# EAGLE board BeagleBone_Black_egl (EAGLE 6.2), part 1 of 4
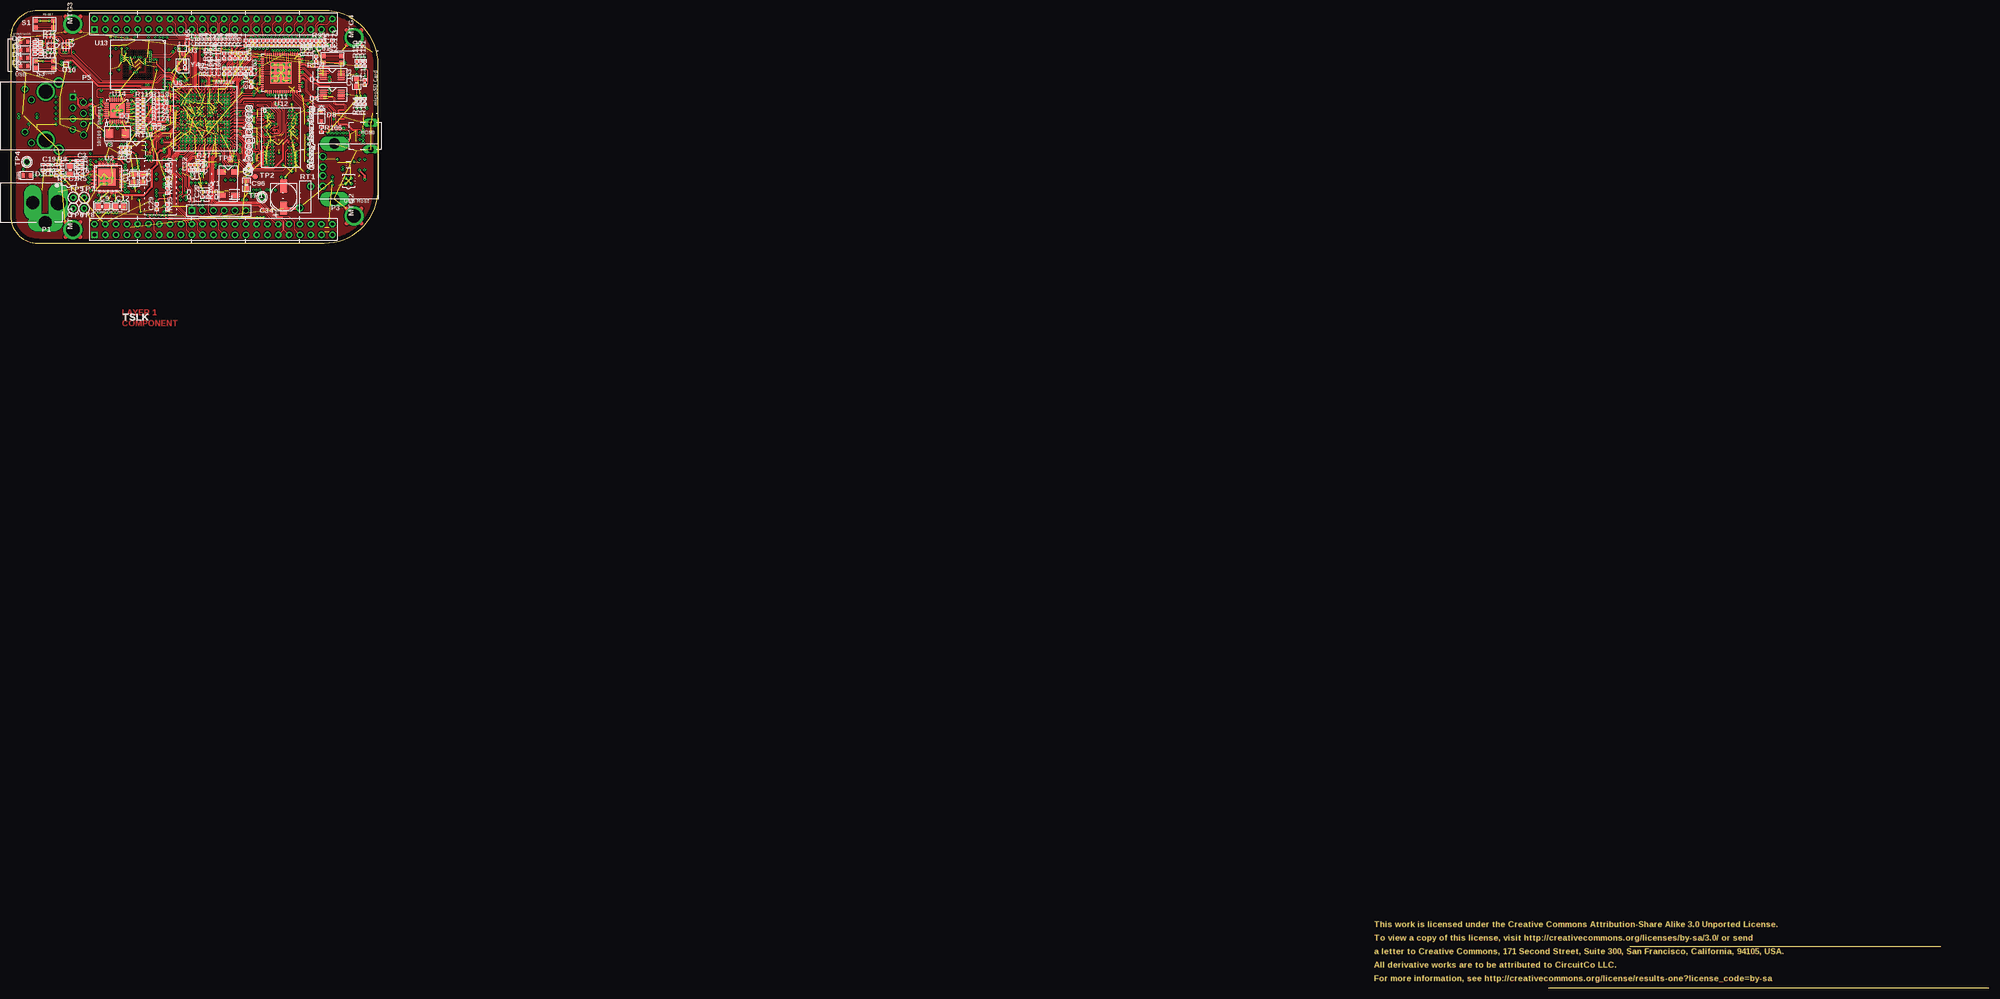
[diagram p14: board, top side]
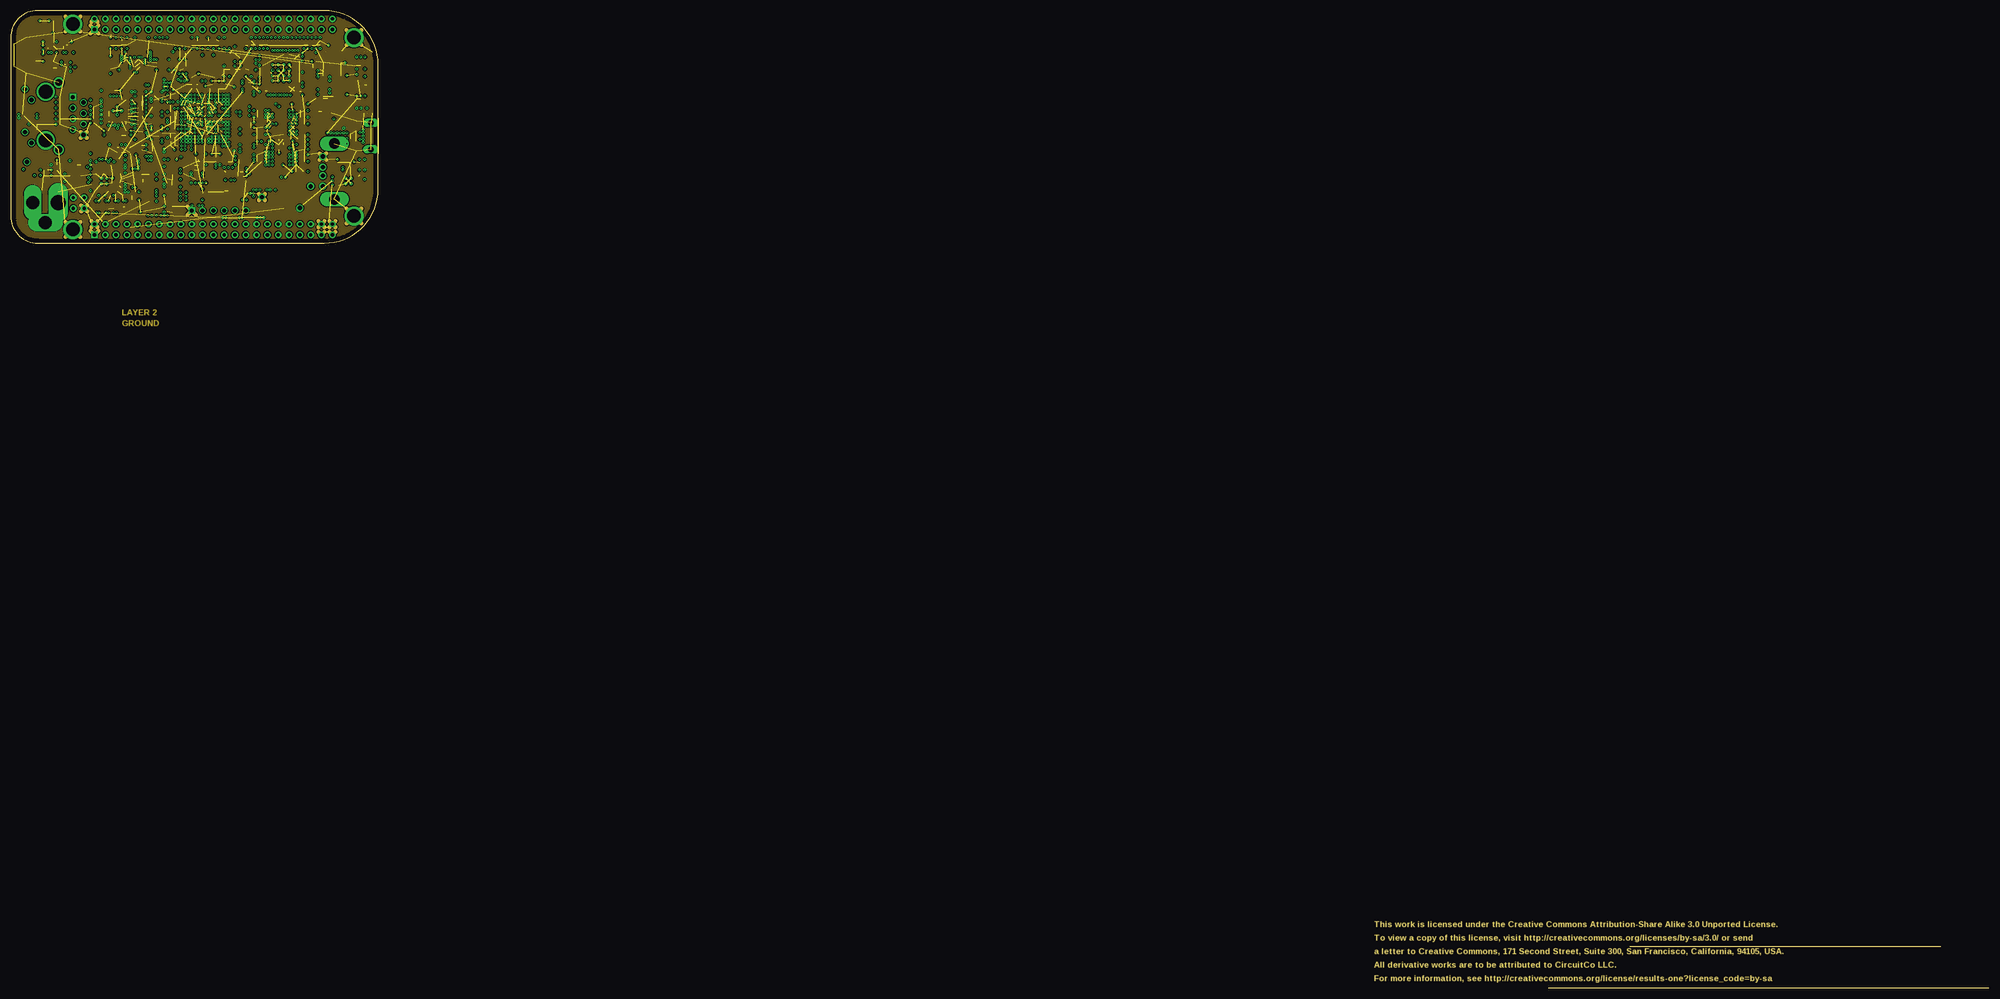
[diagram p15: board, inner layer Route2]
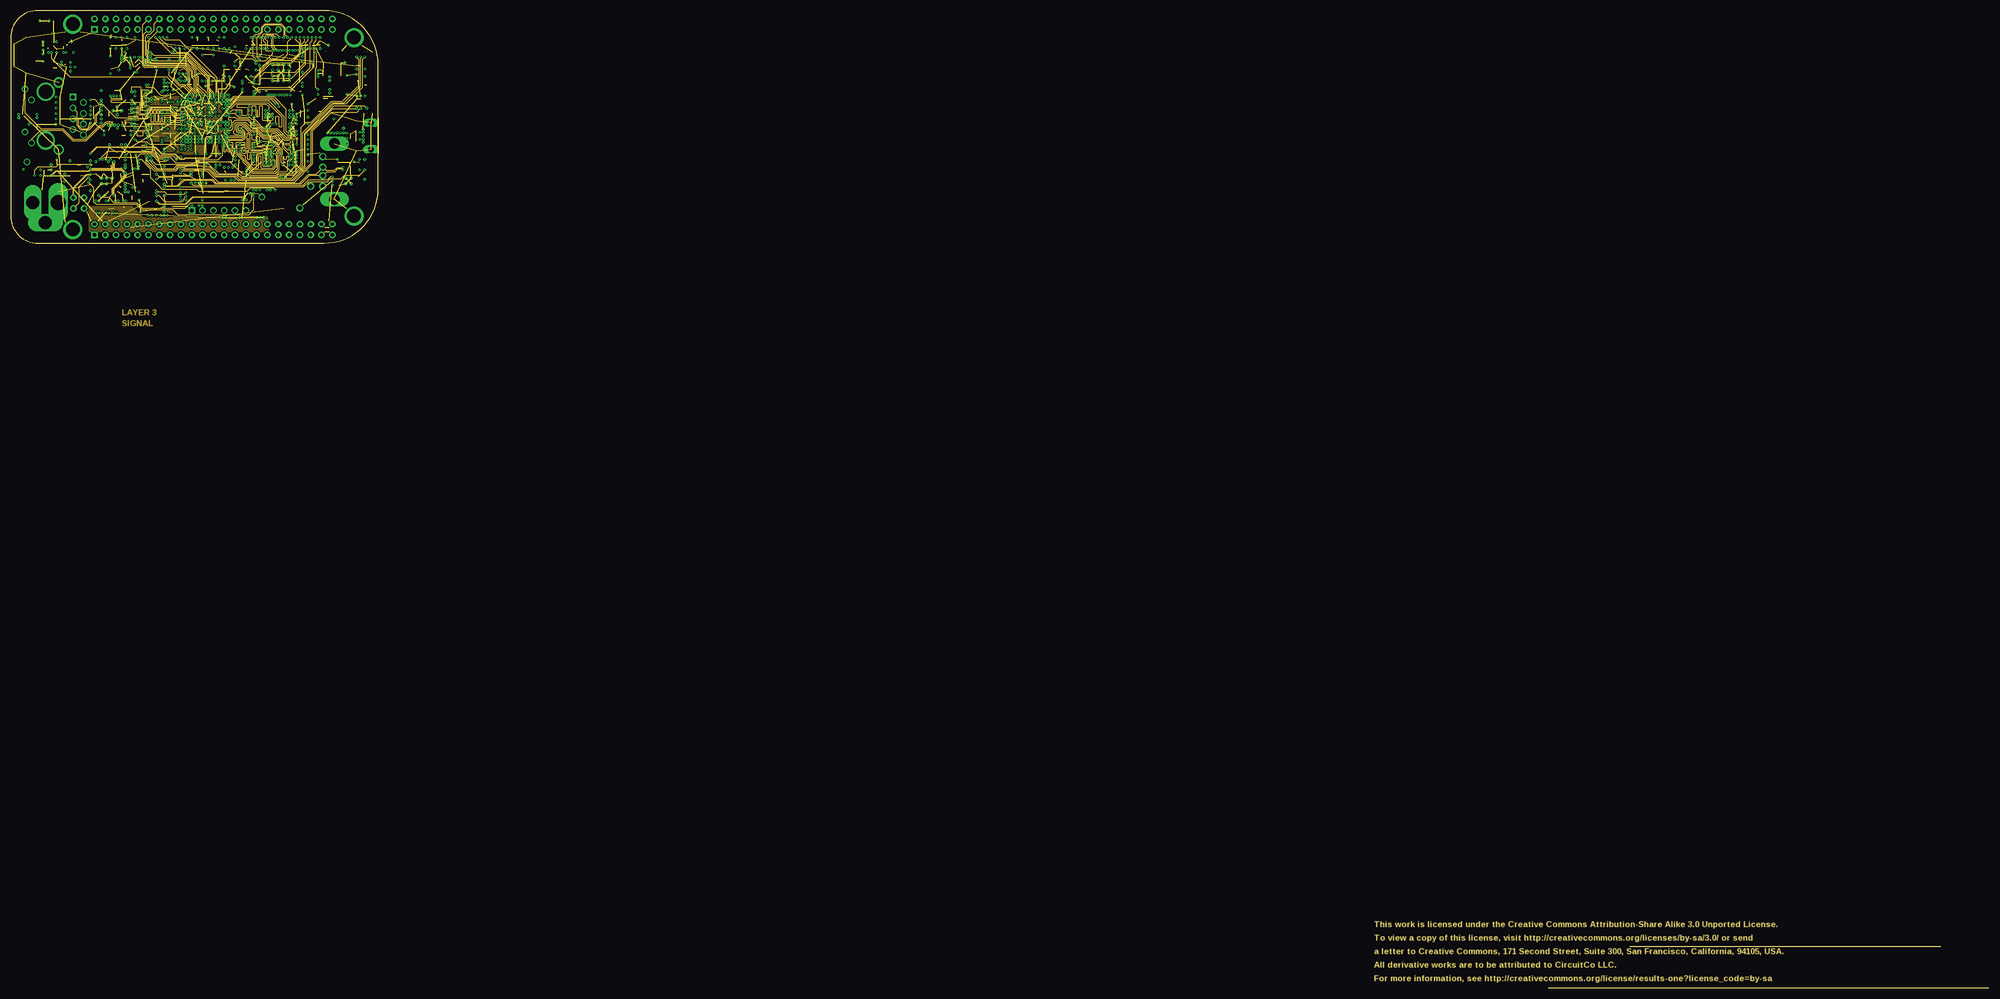
[diagram p16: board, inner layer Route3]
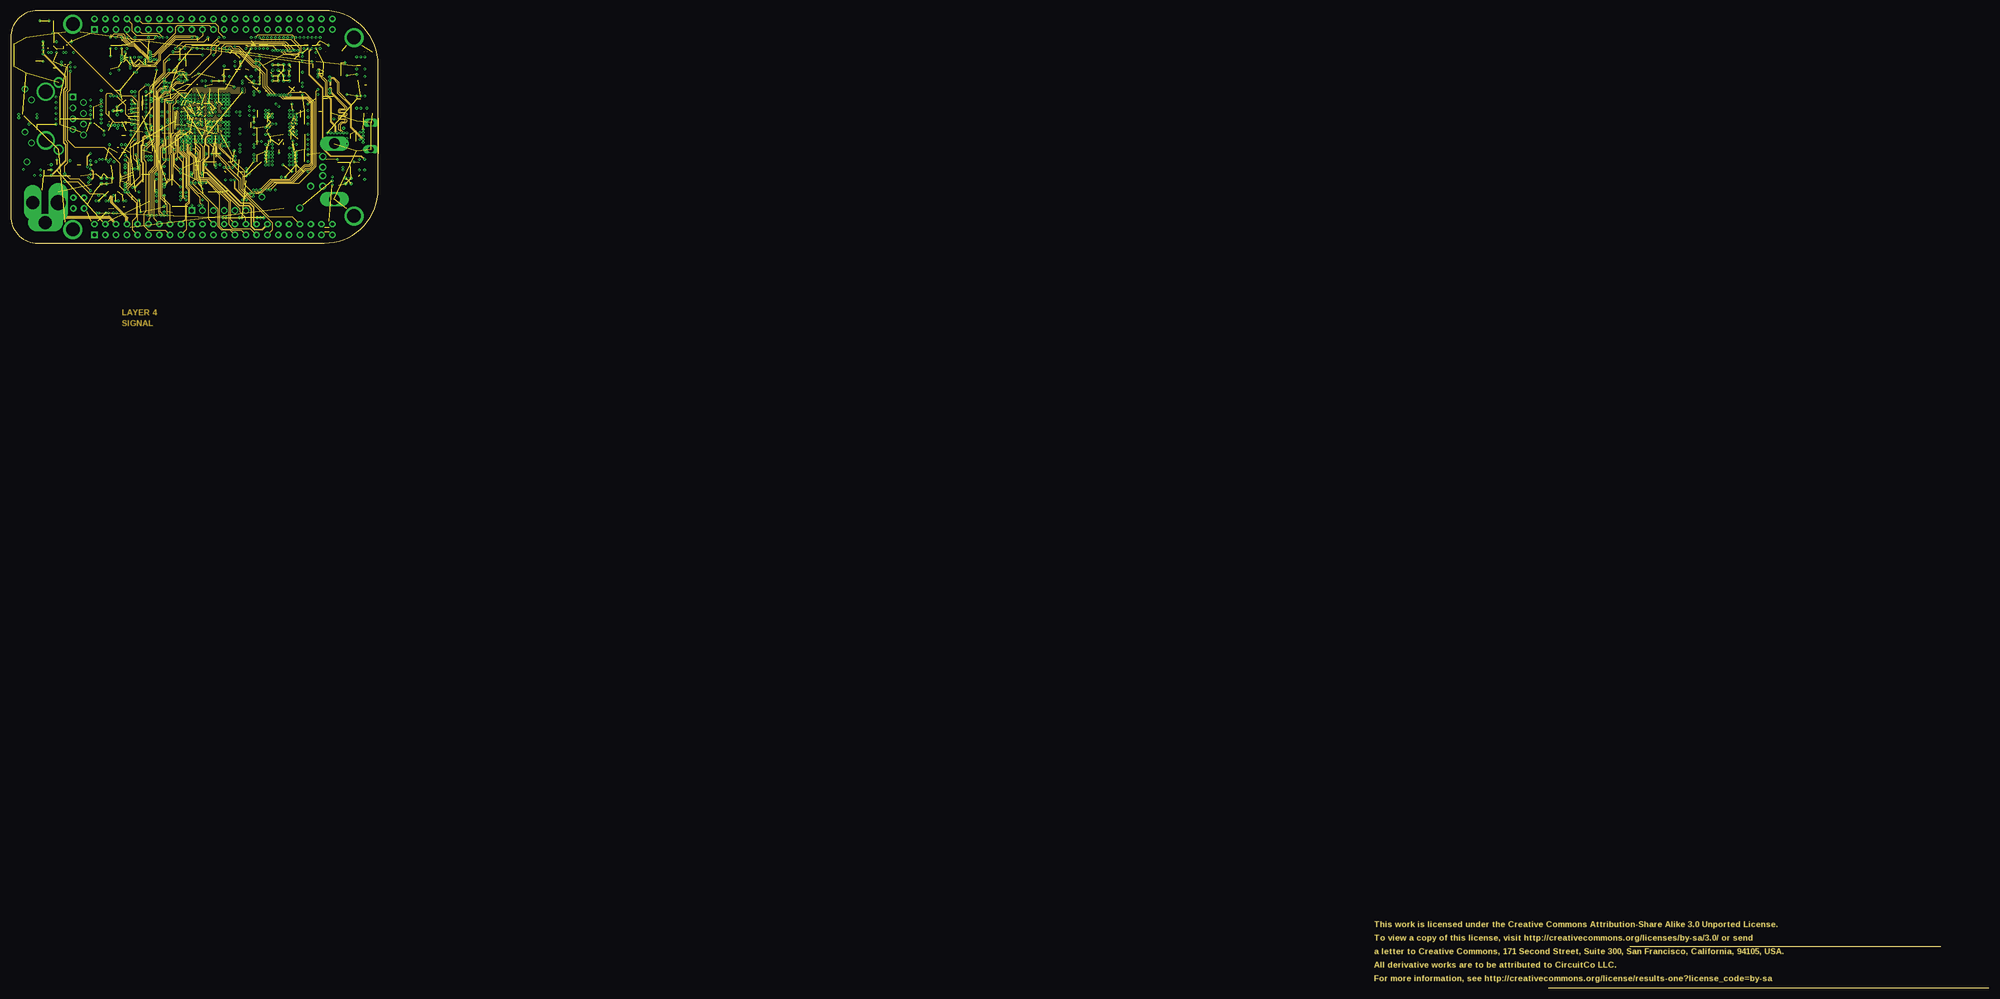
[diagram p17: board, inner layer Route14]
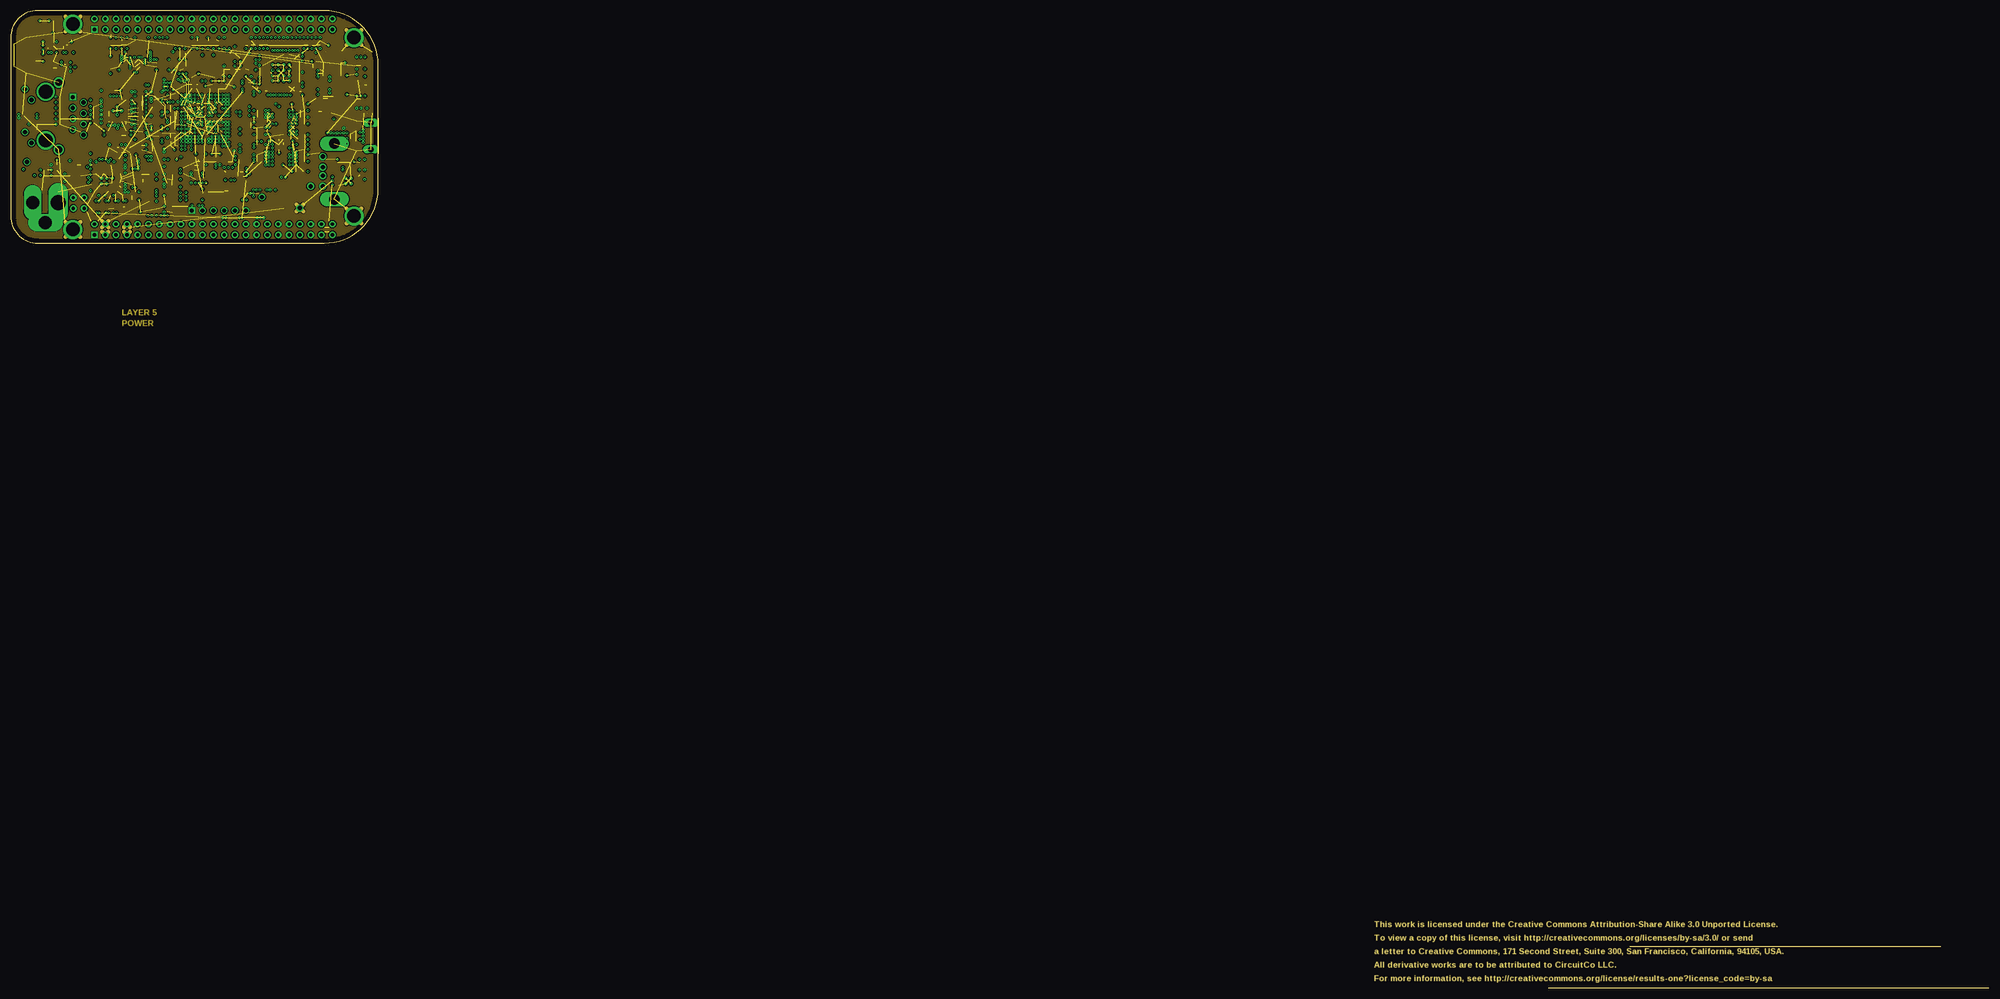
[diagram p18: board, inner layer Route15]
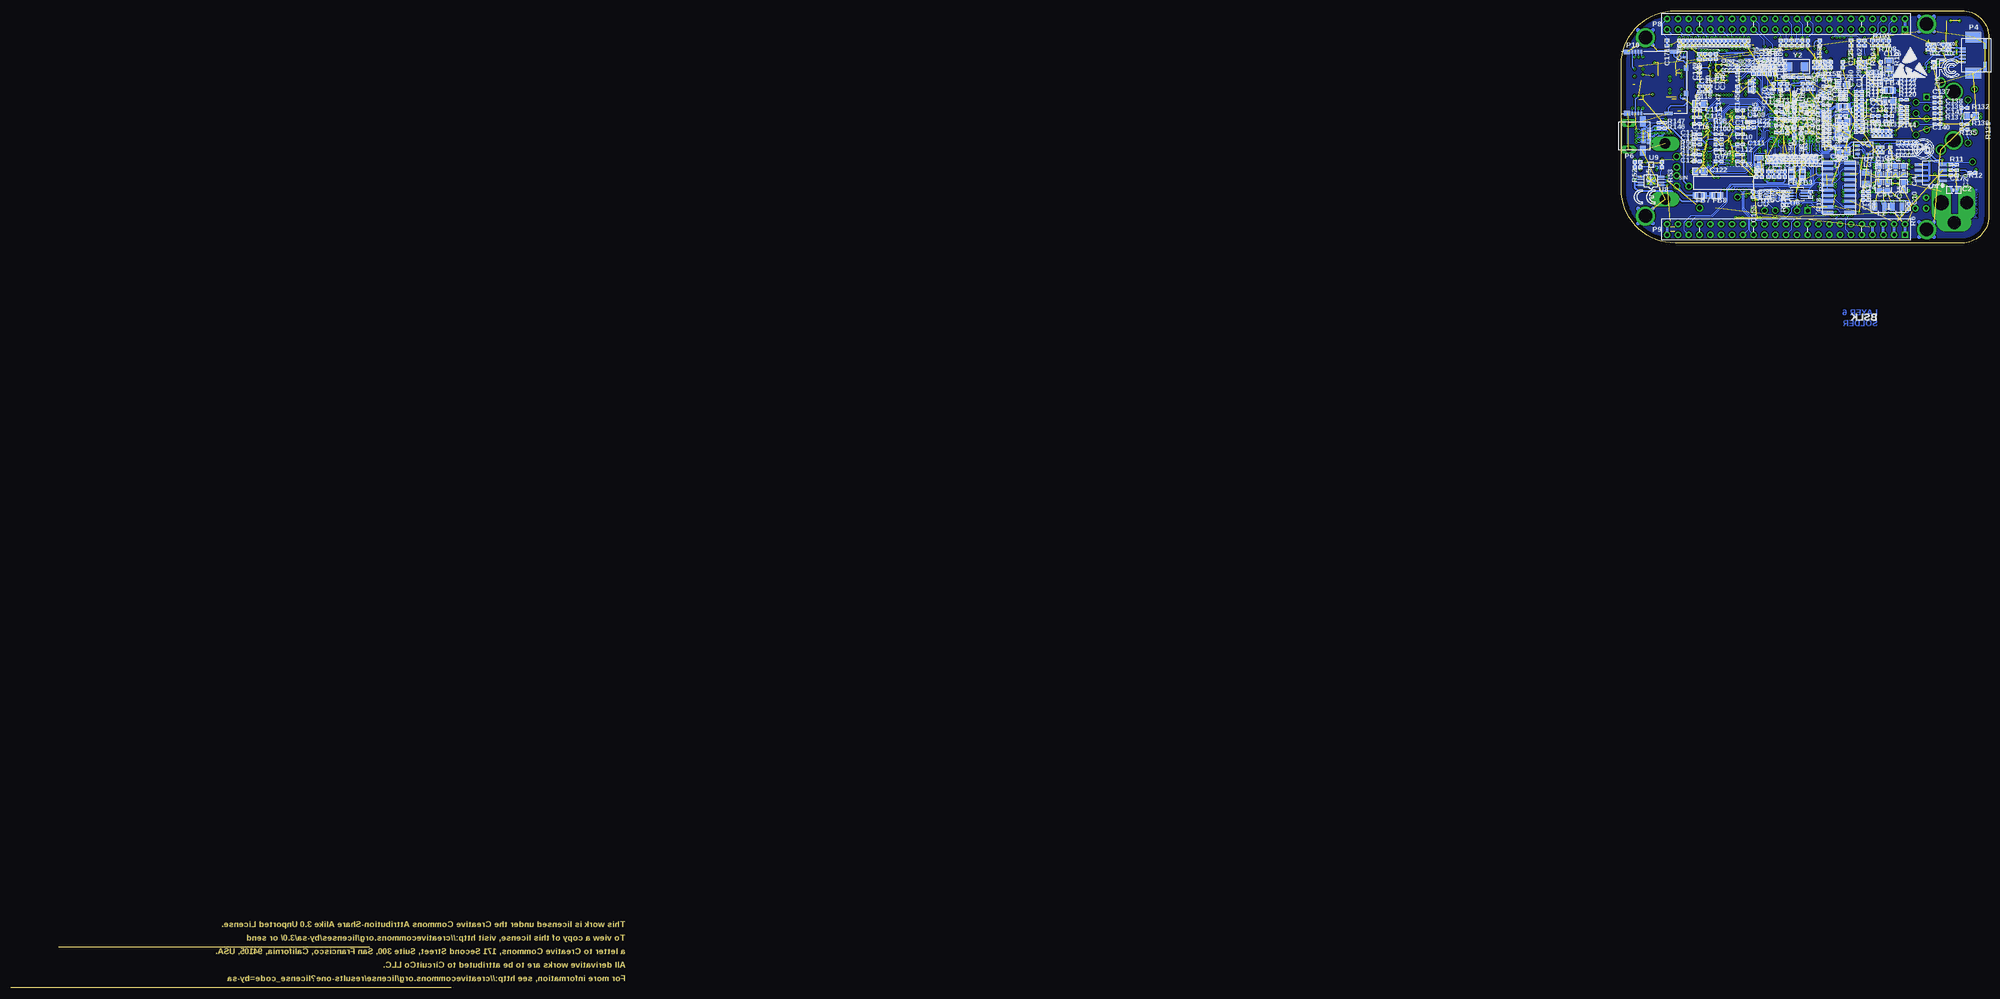
[diagram p19: board, bottom side, seen from below]

Size 464.69 x 229.62 mm. Coordinates in mm from the lower left corner, seen from the top.
Outline: 73.66,175.01 arc90 86.36,187.71
Outline: 86.36,216.92 arc90 73.66,229.62
Outline: 6.35,229.62 arc90 0,223.27
Outline: 0,181.36 arc90 6.35,175.01
Outline: 453.39,9.65 380.37,9.65
Outline: 361.19,0 464.69,0
Outline: 6.35,175.01 73.66,175.01
Outline: 73.66,175.01 arc90 86.36,187.71
Outline: 86.36,187.71 86.36,216.92
Outline: 86.36,216.92 arc90 73.66,229.62
Outline: 73.66,229.62 6.35,229.62
Outline: 6.35,229.62 arc90 0,223.27
Outline: 0,223.27 0,181.36
Outline: 0,181.36 arc90 6.35,175.01
Copper layers (1*2*3*14*15*16): Top 0.035mm / dielectric 1.5mm / Route2 0.035mm / dielectric 0.15mm / Route3 0.035mm / dielectric 0.2mm / Route14 0.035mm / dielectric 0.15mm / Route15 0.035mm / dielectric 0.2mm / Bottom 0.035mm
Design rules: minimum track width 10mil, minimum drill 24mil, track to track 8mil, track to pad 8mil, pad to pad 8mil, via to via 8mil, smd to smd 8mil, copper to edge 40mil, drill to drill 8mil, minimum pad ring 10mil, minimum via ring 8mil, stop-mask expansion 4mil, vias tented up to drill 0mil, thermal gap 10mil

## Footprints (pad centres in the part's own frame; a part is rotated, then mirrored left to right if it is on the bottom)
805 = smd 1.143 x 1.27: 1 -0.889,0; 2 0.889,0
402 = smd 0.635 x 0.508: 1 -0.508,0; 2 0.508,0
RD205SMD_250D = smd 3.048 x 1.651: 1 -2.603,0; 2 2.603,0
0402 = smd 0.635 x 0.508: 1 -0.508,0; 2 0.508,0
LED_0603 = smd 0.762 x 1.016: 1 -0.826,0; 2 0.826,0
TSSOP10 = smd 0.305 x 1.905: 1 -1,-1.981 | smd 0.305 x 1.651: 2 -0.5,-2.108; 3 0,-2.108; 4 0.5,-2.108; 5 1,-2.108; 6 1,2.108; 7 0.5,2.108; 8 0,2.108; 9 -0.5,2.108; 10 -1,2.108
SOD323 = smd 0.8 x 0.8: 1 1.125,0; 2 -1.125,0
SM-7351-IND-0805 = smd 1.397 x 1.549: 1 -0.95,0; 2 0.95,0
SIP6 = drill 1.016 pad 1.524 square: 1 0,0 | drill 1.016 pad 1.524: 2 0,-2.54; 3 0,-5.08; 4 0,-7.62; 5 0,-10.16; 6 0,-12.7
2520 = smd 1.143 x 1.905: 1 -1.143,0; 2 1.143,0
MTGH200C125D_PL = drill 3.175 pad 4.445: 1 0,0
CONN3-PWR-PJ102A = drill 3.556 pad 1.778 long: 1 0,0 | drill 3.048 pad 1.778 long: 2 5.994,0; 3 2.997,4.699
HEADER10X2_SMD = smd 0.711 x 2.794: 1 -5.715,-2.705; 2 -5.715,2.705; 3 -4.445,-2.705; 4 -4.445,2.705; 5 -3.175,-2.705; 6 -3.175,2.705; 7 -1.905,-2.705; 8 -1.905,2.705; 9 -0.635,-2.705; 10 -0.635,2.705; 11 0.635,-2.705; 12 0.635,2.705; 13 1.905,-2.705; 14 1.905,2.705; 15 3.175,-2.705; 16 3.175,2.705; 17 4.445,-2.705; 18 4.445,2.705; 19 5.715,-2.705; 20 5.715,2.705
USB_A_SH = drill 1.016 pad 1.651: 1 0,0; 2 2.499,0; 3 4.501,0; 4 7,0 | drill 2.413 pad 2.032 long: 5 -3.071,-2.71; 6 10.071,-2.71
USB5MINI_4SHIELDED_SMD-5 = smd 1.4 x 0.5: 1 0,1.6; 2 0,0.8; 3 0,0; 4 0,-0.8; 5 0,-1.6 | smd 3.81 x 2.54: 6 -2.4,4.2; 7 -2.4,-4.2 | smd 0.8 x 2.35: 8 -5.2,2.675; 9 -5.2,-2.675
RJ45-7499010211A = drill 1.016 pad 1.524 square: 1 0,0 | drill 1.016 pad 1.524: 2 1.27,2.54; 3 2.54,0; 4 3.81,2.54; 5 5.08,0; 6 6.35,2.54; 7 7.62,0; 8 8.89,2.54; 9 -1.88,-11.252; 10 0.66,-9.728; 11 8.23,-11.252; 12 10.77,-9.728 | drill 1.6 pad 2.286: 13 -3.429,-3.302; 14 12.319,-3.302 | drill 3.251 pad 1.016: MECH_15 -1.27,-6.35; MECH_16 10.16,-6.35
CONN19_HDMI = smd 0.23 x 0.85: 1 1.8,4.765; 3 1.4,4.765; 5 1,4.765; 7 0.6,4.765; 9 0.2,4.765; 11 -0.2,4.765; 13 -0.6,4.765; 15 -1,4.765; 17 -1.4,4.765; 19 -1.8,4.765 | smd 0.23 x 1: 2 1.6,3.54; 4 1.2,3.54; 6 0.8,3.54; 8 0.4,3.54; 10 0,3.54; 12 -0.4,3.54; 14 -0.8,3.54; 16 -1.2,3.54; 18 -1.6,3.54 | drill 1.27 pad 1.651 long: 20 3.1,0; 21 -3.1,0 | smd 2.4 x 1.38: 22 3.45,3.36; 23 -3.45,3.36
HEADER23X2 = drill 0.762 pad 1.524 square: 1 0,0 | drill 0.762 pad 1.524: 2 0,2.54; 3 2.54,0; 4 2.54,2.54; 5 5.08,0; 6 5.08,2.54; 7 7.62,0; 8 7.62,2.54; 9 10.16,0; 10 10.16,2.54; 11 12.7,0; 12 12.7,2.54; 13 15.24,0; 14 15.24,2.54; 15 17.78,0; 16 17.78,2.54; 17 20.32,0; 18 20.32,2.54; 19 22.86,0; 20 22.86,2.54; 21 25.4,0; 22 25.4,2.54; 23 27.94,0; 24 27.94,2.54; 25 30.48,0; 26 30.48,2.54; 27 33.02,0; 28 33.02,2.54; 29 35.56,0; 30 35.56,2.54; 31 38.1,0; 32 38.1,2.54; 33 40.64,0; 34 40.64,2.54; 35 43.18,0; 36 43.18,2.54; 37 45.72,0; 38 45.72,2.54; 39 48.26,0; 40 48.26,2.54; 41 50.8,0; 42 50.8,2.54; 43 53.34,0; 44 53.34,2.54; 45 55.88,0; 46 55.88,2.54
SD-MICRO-SCHA5B0300 = smd 0.914 x 0.457: 1 -7.257,0; 2 -7.257,-0.7; 3 -7.257,-1.4; 4 -7.257,-2.1; 5 7.257,-2.1; 6 7.257,-1.4; 7 7.257,-0.7; 8 7.257,0 | smd 0.508 x 0.889: 9 3.775,9.989; 10 -5.975,9.989 | smd 0.889 x 2.007: 11 -7.25,7.635; 12 7.25,6.335 | smd 1.118 x 1.524: 13 -7.196,-3.365; 14 7.196,-3.365 | smd 1.194 x 1.092: 15 -3.425,10.488; 16 2.575,10.488
SMINI6-F3-B = smd 0.305 x 0.95: 1 0.65,0.75; 2 0,0.75; 3 -0.65,0.75; 4 -0.65,-0.75; 5 0,-0.75; 6 0.65,-0.75
SM-7351-RES-0402 = smd 0.635 x 0.635: 1 -0.508,0; 2 0.508,0
POLYSW200-5638-310 = drill 1.016 pad 1.651: 1 -5.08,2.54; 2 0,0
SW4SMD_63X161LS = smd 0.889 x 1.016: 1 -2.05,-0.8; 2 -2.05,0.8; 3 2.05,-0.8; 4 2.05,0.8
TP1-8040 = drill 1.016 pad 1.524: 1 0,0
TP60C_SMD = smd 1.27 x 1.27: 1 0,0
TP60C33D = drill 0.762 pad 1.524: 1 0,0
U_48_RSL = smd 0.8 x 0.2: 1 -3.075,2.2; 2 -3.075,1.8; 3 -3.075,1.4; 4 -3.075,1; 5 -3.075,0.6; 6 -3.075,0.2; 7 -3.075,-0.2; 8 -3.075,-0.6; 9 -3.075,-1; 10 -3.075,-1.4; 11 -3.075,-1.8; 12 -3.075,-2.2; 25 3.075,-2.2; 26 3.075,-1.8; 27 3.075,-1.4; 28 3.075,-1; 29 3.075,-0.6; 30 3.075,-0.2; 31 3.075,0.2; 32 3.075,0.6; 33 3.075,1; 34 3.075,1.4; 35 3.075,1.8; 36 3.075,2.2 | smd 0.2 x 0.8: 13 -2.2,-3.075; 14 -1.8,-3.075; 15 -1.4,-3.075; 16 -1,-3.075; 17 -0.6,-3.075; 18 -0.2,-3.075; 19 0.2,-3.075; 20 0.6,-3.075; 21 1,-3.075; 22 1.4,-3.075; 23 1.8,-3.075; 24 2.2,-3.075; 37 2.2,3.075; 38 1.8,3.075; 39 1.4,3.075; 40 1,3.075; 41 0.6,3.075; 42 0.2,3.075; 43 -0.2,3.075; 44 -0.6,3.075; 45 -1,3.075; 46 -1.4,3.075; 47 -1.8,3.075; 48 -2.2,3.075 | smd 4.05 x 4.05: 49 -0.225,0.225
DCK5_2P15X1P4 = smd 0.4 x 0.9: 1 -0.65,-1.1; 2 0,-1.1; 3 0.65,-1.1; 4 0.65,1.1; 5 -0.65,1.1
SO8-25X75 = smd 0.635 x 1.905: 1 -1.905,-2.794; 2 -0.635,-2.794; 3 0.635,-2.794; 4 1.905,-2.794; 5 1.905,2.794; 6 0.635,2.794; 7 -0.635,2.794; 8 -1.905,2.794
AM33XX_15X15 = smd 0.356 x 0.356: A1 -6.8,6.8; A2 -6,6.8; A3 -5.2,6.8; A4 -4.4,6.8; A5 -3.6,6.8; A6 -2.8,6.8; A7 -2,6.8; A8 -1.2,6.8; A9 -0.4,6.8; A10 0.4,6.8; A11 1.2,6.8; A12 2,6.8; A13 2.8,6.8; A14 3.6,6.8; A15 4.4,6.8; A16 5.2,6.8; A17 6,6.8; A18 6.8,6.8; B1 -6.8,6; B2 -6,6; B3 -5.2,6; B4 -4.4,6; B5 -3.6,6; B6 -2.8,6; B7 -2,6; B8 -1.2,6; B9 -0.4,6; B10 0.4,6; B11 1.2,6; B12 2,6; B13 2.8,6; B14 3.6,6; B15 4.4,6; B16 5.2,6; B17 6,6; B18 6.8,6; C1 -6.8,5.2; C2 -6,5.2; C3 -5.2,5.2; C4 -4.4,5.2; C5 -3.6,5.2; C6 -2.8,5.2; C7 -2,5.2; C8 -1.2,5.2; C9 -0.4,5.2; C10 0.4,5.2; C11 1.2,5.2; C12 2,5.2; C13 2.8,5.2; C14 3.6,5.2; C15 4.4,5.2; C16 5.2,5.2; C17 6,5.2; C18 6.8,5.2; D1 -6.8,4.4; D2 -6,4.4; D3 -5.2,4.4; D4 -4.4,4.4; D5 -3.6,4.4; D6 -2.8,4.4; D7 -2,4.4; D8 -1.2,4.4; D9 -0.4,4.4; D10 0.4,4.4; D11 1.2,4.4; D12 2,4.4; D13 2.8,4.4; D14 3.6,4.4; D15 4.4,4.4; D16 5.2,4.4; D17 6,4.4; D18 6.8,4.4; E1 -6.8,3.6; E2 -6,3.6; E3 -5.2,3.6; E4 -4.4,3.6; E5 -3.6,3.6; E6 -2.8,3.6; E7 -2,3.6; E8 -1.2,3.6; E9 -0.4,3.6; E10 0.4,3.6; E11 1.2,3.6; E12 2,3.6; E13 2.8,3.6; E14 3.6,3.6; E15 4.4,3.6; E16 5.2,3.6; E17 6,3.6; E18 6.8,3.6; F1 -6.8,2.8; F2 -6,2.8; F3 -5.2,2.8; F4 -4.4,2.8; F5 -3.6,2.8; F6 -2.8,2.8; F7 -2,2.8; F8 -1.2,2.8; F9 -0.4,2.8; F10 0.4,2.8; F11 1.2,2.8; F12 2,2.8; F13 2.8,2.8; F14 3.6,2.8; F15 4.4,2.8; F16 5.2,2.8; F17 6,2.8; F18 6.8,2.8; G1 -6.8,2; G2 -6,2; G3 -5.2,2; G4 -4.4,2; G5 -3.6,2; G6 -2.8,2; G7 -2,2; G8 -1.2,2; G9 -0.4,2; G10 0.4,2; G11 1.2,2; G12 2,2; G13 2.8,2; G14 3.6,2; G15 4.4,2; G16 5.2,2; G17 6,2; G18 6.8,2; H1 -6.8,1.2; H2 -6,1.2; H3 -5.2,1.2; H4 -4.4,1.2; H5 -3.6,1.2; H6 -2.8,1.2; H7 -2,1.2; H8 -1.2,1.2; H9 -0.4,1.2; H10 0.4,1.2; H11 1.2,1.2; H12 2,1.2; H13 2.8,1.2; H14 3.6,1.2; H15 4.4,1.2; H16 5.2,1.2; H17 6,1.2; H18 6.8,1.2; J1 -6.8,0.4; J2 -6,0.4; J3 -5.2,0.4; J4 -4.4,0.4; J5 -3.6,0.4; J6 -2.8,0.4; J7 -2,0.4; J8 -1.2,0.4; J9 -0.4,0.4; J10 0.4,0.4; J11 1.2,0.4; J12 2,0.4; J13 2.8,0.4; J14 3.6,0.4; J15 4.4,0.4; J16 5.2,0.4; J17 6,0.4; J18 6.8,0.4; K1 -6.8,-0.4; K2 -6,-0.4; K3 -5.2,-0.4; K4 -4.4,-0.4; K5 -3.6,-0.4; K6 -2.8,-0.4; K7 -2,-0.4; K8 -1.2,-0.4; K9 -0.4,-0.4; K10 0.4,-0.4; K11 1.2,-0.4; K12 2,-0.4; K13 2.8,-0.4; K14 3.6,-0.4; K15 4.4,-0.4; K16 5.2,-0.4; K17 6,-0.4; K18 6.8,-0.4; L1 -6.8,-1.2; L2 -6,-1.2; L3 -5.2,-1.2; L4 -4.4,-1.2; L5 -3.6,-1.2; L6 -2.8,-1.2; L7 -2,-1.2; L8 -1.2,-1.2; L9 -0.4,-1.2; L10 0.4,-1.2; L11 1.2,-1.2; L12 2,-1.2; L13 2.8,-1.2; L14 3.6,-1.2; L15 4.4,-1.2; L16 5.2,-1.2; L17 6,-1.2; L18 6.8,-1.2; M1 -6.8,-2; M2 -6,-2; M3 -5.2,-2; M4 -4.4,-2; M5 -3.6,-2; M6 -2.8,-2; M7 -2,-2; M8 -1.2,-2; M9 -0.4,-2; M10 0.4,-2; M11 1.2,-2; M12 2,-2; M13 2.8,-2; M14 3.6,-2; M15 4.4,-2; M16 5.2,-2; M17 6,-2; M18 6.8,-2; N1 -6.8,-2.8; N2 -6,-2.8; N3 -5.2,-2.8; N4 -4.4,-2.8; N5 -3.6,-2.8; N6 -2.8,-2.8; N7 -2,-2.8; N8 -1.2,-2.8; N9 -0.4,-2.8; N10 0.4,-2.8; N11 1.2,-2.8; N12 2,-2.8; N13 2.8,-2.8; N14 3.6,-2.8; N15 4.4,-2.8; N16 5.2,-2.8; N17 6,-2.8; N18 6.8,-2.8; P1 -6.8,-3.6; P2 -6,-3.6; P3 -5.2,-3.6; P4 -4.4,-3.6; P5 -3.6,-3.6; P6 -2.8,-3.6; P7 -2,-3.6; P8 -1.2,-3.6; P9 -0.4,-3.6; P10 0.4,-3.6; P11 1.2,-3.6; P12 2,-3.6; P13 2.8,-3.6; P14 3.6,-3.6; P15 4.4,-3.6; P16 5.2,-3.6; P17 6,-3.6; P18 6.8,-3.6; R1 -6.8,-4.4; R2 -6,-4.4; R3 -5.2,-4.4; R4 -4.4,-4.4; R5 -3.6,-4.4; R6 -2.8,-4.4; R7 -2,-4.4; R8 -1.2,-4.4; R9 -0.4,-4.4; R10 0.4,-4.4; R11 1.2,-4.4; R12 2,-4.4; R13 2.8,-4.4; R14 3.6,-4.4; R15 4.4,-4.4; R16 5.2,-4.4; R17 6,-4.4; R18 6.8,-4.4; T1 -6.8,-5.2; T2 -6,-5.2; T3 -5.2,-5.2; T4 -4.4,-5.2; T5 -3.6,-5.2; T6 -2.8,-5.2; T7 -2,-5.2; T8 -1.2,-5.2; T9 -0.4,-5.2; T10 0.4,-5.2; T11 1.2,-5.2; T12 2,-5.2; T13 2.8,-5.2; T14 3.6,-5.2; T15 4.4,-5.2; T16 5.2,-5.2; T17 6,-5.2; T18 6.8,-5.2; U1 -6.8,-6; U2 -6,-6; U3 -5.2,-6; U4 -4.4,-6; U5 -3.6,-6; U6 -2.8,-6; U7 -2,-6; U8 -1.2,-6; U9 -0.4,-6; U10 0.4,-6; U11 1.2,-6; U12 2,-6; U13 2.8,-6; U14 3.6,-6; U15 4.4,-6; U16 5.2,-6; U17 6,-6; U18 6.8,-6; V1 -6.8,-6.8; V2 -6,-6.8; V3 -5.2,-6.8; V4 -4.4,-6.8; V5 -3.6,-6.8; V6 -2.8,-6.8; V7 -2,-6.8; V8 -1.2,-6.8; V9 -0.4,-6.8; V10 0.4,-6.8; V11 1.2,-6.8; V12 2,-6.8; V13 2.8,-6.8; V14 3.6,-6.8; V15 4.4,-6.8; V16 5.2,-6.8; V17 6,-6.8; V18 6.8,-6.8
SOP8_DCT = smd 0.305 x 1.6: 1 -0.975,-1.702; 2 -0.325,-1.702; 3 0.325,-1.702; 4 0.975,-1.702; 5 0.975,1.702; 6 0.325,1.702; 7 -0.325,1.702; 8 -0.975,1.702
SOT23-5 = smd 0.635 x 1.016: 1 -0.953,-1.295; 2 0,-1.295; 3 0.953,-1.295; 4 0.953,1.295; 5 -0.953,1.295
DGN-16X60 = smd 0.406 x 1.524: 1 -0.975,-2.311; 2 -0.325,-2.311; 3 0.325,-2.311; 4 0.975,-2.311; 5 0.975,2.311; 6 0.325,2.311; 7 -0.325,2.311; 8 -0.975,2.311 | smd 2.032 x 2.032: 9 0,0
U_6_DRY = smd 0.305 x 0.508: 1 -0.5,-0.439; 2 0,-0.439; 3 0.5,-0.439; 4 0.5,0.439; 5 0,0.439; 6 -0.5,0.439
QFN64S9X9P5 = smd 0.6 x 0.25: 1 -4.35,3.75; 2 -4.35,3.25; 3 -4.35,2.75; 4 -4.35,2.25; 5 -4.35,1.75; 6 -4.35,1.25; 7 -4.35,0.75; 8 -4.35,0.25; 9 -4.35,-0.25; 10 -4.35,-0.75; 11 -4.35,-1.25; 12 -4.35,-1.75; 13 -4.35,-2.25; 14 -4.35,-2.75; 15 -4.35,-3.25; 16 -4.35,-3.75; 33 4.35,-3.75; 34 4.35,-3.25; 35 4.35,-2.75; 36 4.35,-2.25; 37 4.35,-1.75; 38 4.35,-1.25; 39 4.35,-0.75; 40 4.35,-0.25; 41 4.35,0.25; 42 4.35,0.75; 43 4.35,1.25; 44 4.35,1.75; 45 4.35,2.25; 46 4.35,2.75; 47 4.35,3.25; 48 4.35,3.75 | smd 0.25 x 0.6: 17 -3.75,-4.35; 18 -3.25,-4.35; 19 -2.75,-4.35; 20 -2.25,-4.35; 21 -1.75,-4.35; 22 -1.25,-4.35; 23 -0.75,-4.35; 24 -0.25,-4.35; 25 0.25,-4.35; 26 0.75,-4.35; 27 1.25,-4.35; 28 1.75,-4.35; 29 2.25,-4.35; 30 2.75,-4.35; 31 3.25,-4.35; 32 3.75,-4.35; 49 3.75,4.35; 50 3.25,4.35; 51 2.75,4.35; 52 2.25,4.35; 53 1.75,4.35; 54 1.25,4.35; 55 0.75,4.35; 56 0.25,4.35; 57 -0.25,4.35; 58 -0.75,4.35; 59 -1.25,4.35; 60 -1.75,4.35; 61 -2.25,4.35; 62 -2.75,4.35; 63 -3.25,4.35; 64 -3.75,4.35 | smd 5.08 x 5.08: 65 0,0
BGA96_T9_P8_9X14 = smd 0.356 x 0.356: A1 -3.2,6.001; A2 -2.4,6.001; A3 -1.6,6.001; A7 1.6,6.001; A8 2.4,6.001; A9 3.2,6.001; B1 -3.2,5.201; B2 -2.4,5.201; B3 -1.6,5.201; B7 1.6,5.201; B8 2.4,5.201; B9 3.2,5.201; C1 -3.2,4.401; C2 -2.4,4.401; C3 -1.6,4.401; C7 1.6,4.401; C8 2.4,4.401; C9 3.2,4.401; D1 -3.2,3.6; D2 -2.4,3.6; D3 -1.6,3.6; D7 1.6,3.6; D8 2.4,3.6; D9 3.2,3.6; E1 -3.2,2.8; E2 -2.4,2.8; E3 -1.6,2.8; E7 1.6,2.8; E8 2.4,2.8; E9 3.2,2.8; F1 -3.2,2; F2 -2.4,2; F3 -1.6,2; F7 1.6,2; F8 2.4,2; F9 3.2,2; G1 -3.2,1.2; G2 -2.4,1.2; G3 -1.6,1.2; G7 1.6,1.2; G8 2.4,1.2; G9 3.2,1.2; H1 -3.2,0.4; H2 -2.4,0.4; H3 -1.6,0.4; H7 1.6,0.4; H8 2.4,0.4; H9 3.2,0.4; J1 -3.2,-0.4; J2 -2.4,-0.4; J3 -1.6,-0.4; J7 1.6,-0.4; J8 2.4,-0.4; J9 3.2,-0.4; K1 -3.2,-1.2; K2 -2.4,-1.2; K3 -1.6,-1.2; K7 1.6,-1.2; K8 2.4,-1.2; K9 3.2,-1.2; L1 -3.2,-2; L2 -2.4,-2; L3 -1.6,-2; L7 1.6,-2; L8 2.4,-2; L9 3.2,-2; M1 -3.2,-2.8; M2 -2.4,-2.8; M3 -1.6,-2.8; M7 1.6,-2.8; M8 2.4,-2.8; M9 3.2,-2.8; N1 -3.2,-3.6; N2 -2.4,-3.6; N3 -1.6,-3.6; N7 1.6,-3.6; N8 2.4,-3.6; N9 3.2,-3.6; P1 -3.2,-4.401; P2 -2.4,-4.401; P3 -1.6,-4.401; P7 1.6,-4.401; P8 2.4,-4.401; P9 3.2,-4.401; R1 -3.2,-5.201; R2 -2.4,-5.201; R3 -1.6,-5.201; R7 1.6,-5.201; R8 2.4,-5.201; R9 3.2,-5.201; T1 -3.2,-6.001; T2 -2.4,-6.001; T3 -1.6,-6.001; T7 1.6,-6.001; T8 2.4,-6.001; T9 3.2,-6.001
BGA153_P14_P5_11P5X13 = smd 0.254 x 0.254: A1 -3.25,3.25; A2 -2.75,3.25; A3 -2.25,3.25; A4 -1.75,3.25; A5 -1.25,3.25; A6 -0.75,3.25; A7 -0.25,3.25; A8 0.25,3.25; A9 0.75,3.25; A10 1.25,3.25; A11 1.75,3.25; A12 2.25,3.25; A13 2.75,3.25; A14 3.25,3.25; B1 -3.25,2.75; B2 -2.75,2.75; B3 -2.25,2.75; B4 -1.75,2.75; B5 -1.25,2.75; B6 -0.75,2.75; B7 -0.25,2.75; B8 0.25,2.75; B9 0.75,2.75; B10 1.25,2.75; B11 1.75,2.75; B12 2.25,2.75; B13 2.75,2.75; B14 3.25,2.75; C1 -3.25,2.25; C2 -2.75,2.25; C3 -2.25,2.25; C4 -1.75,2.25; C5 -1.25,2.25; C6 -0.75,2.25; C7 -0.25,2.25; C8 0.25,2.25; C9 0.75,2.25; C10 1.25,2.25; C11 1.75,2.25; C12 2.25,2.25; C13 2.75,2.25; C14 3.25,2.25; D1 -3.25,1.75; D2 -2.75,1.75; D3 -2.25,1.75; D4 -1.75,1.75; D12 2.25,1.75; D13 2.75,1.75; D14 3.25,1.75; E1 -3.25,1.25; E2 -2.75,1.25; E3 -2.25,1.25; E5 -1.25,1.25; E6 -0.75,1.25; E7 -0.25,1.25; E8 0.25,1.25; E9 0.75,1.25; E10 1.25,1.25; E12 2.25,1.25; E13 2.75,1.25; E14 3.25,1.25; F1 -3.25,0.75; F2 -2.75,0.75; F3 -2.25,0.75; F5 -1.25,0.75; F10 1.25,0.75; F12 2.25,0.75; F13 2.75,0.75; F14 3.25,0.75; G1 -3.25,0.25; G2 -2.75,0.25; G3 -2.25,0.25; G5 -1.25,0.25; G10 1.25,0.25; G12 2.25,0.25; G13 2.75,0.25; G14 3.25,0.25; H1 -3.25,-0.25; H2 -2.75,-0.25; H3 -2.25,-0.25; H5 -1.25,-0.25; H10 1.25,-0.25; H12 2.25,-0.25; H13 2.75,-0.25; H14 3.25,-0.25; J1 -3.25,-0.75; J2 -2.75,-0.75; J3 -2.25,-0.75; J5 -1.25,-0.75; J10 1.25,-0.75; J12 2.25,-0.75; J13 2.75,-0.75; J14 3.25,-0.75; K1 -3.25,-1.25; K2 -2.75,-1.25; K3 -2.25,-1.25; K5 -1.25,-1.25; K6 -0.75,-1.25; K7 -0.25,-1.25; K8 0.25,-1.25; K9 0.75,-1.25; K10 1.25,-1.25; K12 2.25,-1.25; K13 2.75,-1.25; K14 3.25,-1.25; L1 -3.25,-1.75; L2 -2.75,-1.75; L3 -2.25,-1.75; L12 2.25,-1.75; L13 2.75,-1.75; L14 3.25,-1.75; M1 -3.25,-2.25; M2 -2.75,-2.25; M3 -2.25,-2.25; M4 -1.75,-2.25; M5 -1.25,-2.25; M6 -0.75,-2.25; M7 -0.25,-2.25; M8 0.25,-2.25; M9 0.75,-2.25; M10 1.25,-2.25; M11 1.75,-2.25; M12 2.25,-2.25; M13 2.75,-2.25; M14 3.25,-2.25; N1 -3.25,-2.75; N2 -2.75,-2.75; N3 -2.25,-2.75; N4 -1.75,-2.75; N5 -1.25,-2.75; N6 -0.75,-2.75; N7 -0.25,-2.75; N8 0.25,-2.75; N9 0.75,-2.75; N10 1.25,-2.75; N11 1.75,-2.75; N12 2.25,-2.75; N13 2.75,-2.75; N14 3.25,-2.75; P1 -3.25,-3.25; P2 -2.75,-3.25; P3 -2.25,-3.25; P4 -1.75,-3.25; P5 -1.25,-3.25; P6 -0.75,-3.25; P7 -0.25,-3.25; P8 0.25,-3.25; P9 0.75,-3.25; P10 1.25,-3.25; P11 1.75,-3.25; P12 2.25,-3.25; P13 2.75,-3.25; P14 3.25,-3.25
QFN32_5X5MM_EP3P3MM = smd 0.254 x 0.838: 1 -1.751,-2.515; 2 -1.251,-2.515; 3 -0.751,-2.515; 4 -0.25,-2.515; 5 0.25,-2.515; 6 0.751,-2.515; 7 1.251,-2.515; 8 1.751,-2.515; 17 1.751,2.515; 18 1.251,2.515; 19 0.751,2.515; 20 0.25,2.515; 21 -0.25,2.515; 22 -0.751,2.515; 23 -1.251,2.515; 24 -1.751,2.515 | smd 0.838 x 0.254: 9 2.515,-1.751; 10 2.515,-1.251; 11 2.515,-0.751; 12 2.515,-0.25; 13 2.515,0.25; 14 2.515,0.751; 15 2.515,1.251; 16 2.515,1.751; 25 -2.515,1.751; 26 -2.515,1.251; 27 -2.515,0.751; 28 -2.515,0.25; 29 -2.515,-0.25; 30 -2.515,-0.751; 31 -2.515,-1.251; 32 -2.515,-1.751 | smd 3.404 x 3.404: 33 0,0
U_8_DCU = smd 0.254 x 1.27: 1 -0.749,-1.473; 2 -0.249,-1.473; 3 0.249,-1.473; 4 0.749,-1.473; 5 0.749,1.473; 6 0.249,1.473; 7 -0.249,1.473; 8 -0.749,1.473
XTAL4_126-216SMD = smd 1.27 x 1.905: 1 -2.748,-1.6; 2 2.751,-1.6; 3 2.751,1.6; 4 -2.748,1.6
XTAL150SMD_125X196 = smd 1.778 x 2.159: 1 -1.9,0; 2 1.9,0
OSC4_61X65LS_79X98SMD = smd 0.711 x 0.889: 1 -0.826,-0.775; 2 0.826,-0.775; 3 0.826,0.775; 4 -0.826,0.775

## Placement (x,y rotation side)
C1  10uF,10V  [805]  13.97,192.15 270 top
C2  10uF,10V  [805]  8.26,187.45 180 bottom
C3  0.1uf,6.3V  [402]  16.19,194.37 0 top
C4  10uF,10V  [805]  20,192.15 90 bottom
C7  10uF,10V  [805]  23.81,188.34 270 bottom
C8  10uF,10V  [805]  25.72,188.34 270 bottom
C9  10uF,10V  [805]  21.53,183.58 180 top
C10  10uF,10V  [805]  20,188.34 90 bottom
C11  10uF,10V  [805]  28.89,190.25 270 top
C12  10uF,10V  [805]  25.59,183.58 0 top
C13  10uF,10V  [805]  23.81,192.15 90 bottom
C14  10uF,10V  [805]  25.72,192.15 90 bottom
C15  10uF,10V  [805]  21.91,192.15 90 bottom
C16  2.2uF,6.3V  [402]  16.19,192.47 180 top
C17  2.2uF,6.3V  [402]  8.26,190.88 0 bottom
C18  2.2uF,6.3V  [402]  16.19,193.42 180 top
C19  470pF,6.3V  [402]  8.26,193.42 180 top
C20  0.1uf,6.3V  [402]  8.26,192.15 0 bottom
C21  18pF,50V  [402]  50.48,191.2 90 bottom
C22  18pF,50V  [402]  51.75,191.2 90 bottom
C24  1uF,10V  [402]  28.89,186.12 180 bottom
C25  18pF,50V  [402]  47.37,214 180 bottom
C26  18pF,50V  [402]  43.05,214 0 bottom
C27  0.1uf,6.3V  [402]  45.09,186.44 90 top
C28  0.1uf,6.3V  [402]  55.88,202.17 180 bottom
C29  0.1uf,6.3V  [402]  34.29,183.58 270 top
C30  0.1uf,6.3V  [402]  28.89,185.17 180 bottom
C31  0.1uf,6.3V  [402]  43.18,192.79 270 top
C32  0.001uf,50V  [402]  42.23,192.79 270 top
C33  0.1uf,6.3V  [402]  44.13,192.79 270 top
C34  100uF,6.3V  [RD205SMD_250D]  64.14,185.8 90 top
C35  0.1uf,6.3V  [402]  81.89,193.42 90 bottom
C36  0.1uf,6.3V  [402]  13.02,216.92 270 bottom
C37  0.1uf,6.3V  [402]  27.94,196.91 270 top
C38  0.1uf,6.3V  [402]  34.29,209.61 0 bottom
C39  10uF,10V  [805]  34.29,200.53 180 bottom
C40  10uF,10V  [805]  34.29,203.45 180 bottom
C41  0.1uf,6.3V  [402]  42.12,207.42 0 bottom
C42  0.1uf,6.3V  [402]  45.72,207.42 270 bottom
C43  0.1uf,6.3V  [402]  47.32,207.02 90 bottom
C44  0.1uf,6.3V  [402]  38.12,200.82 0 bottom
C45  0.1uf,6.3V  [402]  38.12,204.82 0 bottom
C46  0.1uf,6.3V  [402]  44.12,204.22 180 bottom
C47  0.1uf,6.3V  [402]  45.72,205.42 270 bottom
C48  0.1uf,6.3V  [402]  47.32,204.22 180 bottom
C49  0.1uf,6.3V  [402]  45.72,203.02 90 bottom
C50  0.1uf,6.3V  [402]  47.32,201.42 90 bottom
C51  0.1uf,6.3V  [402]  34.29,204.85 0 bottom
C52  0.1uf,6.3V  [402]  34.29,201.99 0 bottom
C53  0.1uf,6.3V  [402]  34.29,199.14 0 bottom
C54  0.1uf,6.3V  [402]  38.12,201.82 0 bottom
C55  10uF,10V  [805]  31.11,190.25 270 top
C56  0.1uf,6.3V  [402]  45.72,209.42 270 bottom
C57  0.1uf,6.3V  [402]  56.52,222 270 top
C58  0.1uf,6.3V  [402]  42.52,211.82 90 bottom
C59  0.1uf,6.3V  [402]  43.5,194.69 270 bottom
C60  0.1uf,6.3V  [402]  42.12,202.62 0 bottom
C61  0.1uf,6.3V  [402]  72.71,222 270 top
C62  10uF,10V  [805]  34.29,196.6 180 bottom
C63  0.1uf,6.3V  [402]  44.12,201.42 90 bottom
C64  0.1uf,6.3V  [402]  34.29,195.01 0 bottom
C65  0.1uf,6.3V  [402]  42.12,204.22 0 bottom
C66  0.1uf,6.3V  [402]  42.12,205.82 0 bottom
C67  0.1uf,6.3V  [402]  34.29,210.57 0 bottom
C68  0.1uf,6.3V  [402]  48.92,211.82 270 bottom
C69  0.1uf,6.3V  [402]  38.12,203.82 180 bottom
C70  0.1uf,6.3V  [402]  42.12,201.02 0 bottom
C71  0.1uf,6.3V  [402]  38.1,211.84 0 bottom
C72  0.1uf,6.3V  [402]  45.72,201.02 270 bottom
C73  0.1uf,6.3V  [402]  49.32,207.42 180 bottom
C74  0.1uf,6.3V  [402]  50.52,211.82 270 bottom
C75  0.1uf,6.3V  [402]  56.52,222 270 bottom
C76  0.1uf,6.3V  [402]  72.71,222 270 bottom
C77  10uF,10V  [805]  34.29,212.15 0 bottom
C78  0.1uf,6.3V  [402]  34.29,208.66 180 bottom
C79  0.1uf,6.3V  [402]  38.12,202.82 0 bottom
C80  0.1uf,6.3V  [402]  41.32,211.82 90 bottom
C81  0.1uf,6.3V  [402]  47.32,211.82 90 bottom
C82  0.1uf,6.3V  [402]  38.12,199.77 0 bottom
C83  0.1uf,6.3V  [402]  38.12,198.82 0 bottom
C84  0.1uf,6.3V  [402]  38.12,207.42 0 bottom
C85  0.1uf,6.3V  [402]  38.12,197.87 0 bottom
C86  0.1uf,6.3V  [402]  38.12,210.25 0 bottom
C87  0.1uf,6.3V  [402]  38.12,205.82 0 bottom
C88  0.1uf,6.3V  [402]  45.72,199.02 270 bottom
C89  1uF,10V  [402]  46.35,194.69 270 bottom
C90  1uF,10V  [402]  44.45,194.69 270 bottom
C91  1uF,10V  [402]  45.4,194.69 270 bottom
C92  0.1uf,6.3V  [402]  48.26,194.69 270 bottom
C93  0.1uf,6.3V  [402]  45.09,192.79 270 top
C94  0.1uf,6.3V  [402]  44.12,207.02 270 bottom
C95  10uF,10V  [805]  53.98,194.06 90 bottom
C96  10uF,10V  [805]  55.37,188.72 90 top
C97  0.1uf,6.3V  [402]  49.32,205.82 0 bottom
C98  0.1uf,6.3V  [402]  49.32,204.22 0 bottom
C99  0.1uf,6.3V  [402]  49.32,202.62 0 bottom
C100  0.1uf,6.3V  [402]  49.32,201.02 0 bottom
C101  0.1uf,6.3V  [402]  52.07,194.69 270 bottom
C102  0.1uf,6.3V  [402]  53.34,191.2 90 bottom
C103  0.1uf,6.3V  [402]  54.61,191.2 90 bottom
C104  1uF,10V  [402]  49.21,194.69 270 bottom
C105  0.1uf,6.3V  [402]  47.31,194.69 270 bottom
C106  0.1uf,6.3V  [402]  43.72,211.82 90 bottom
C107  0.1uf,6.3V  [402]  58.42,206.17 0 bottom
C108  0.1uf,6.3V  [402]  58.42,204.57 0 bottom
C109  0.1uf,6.3V  [402]  58.42,202.17 0 bottom
C110  0.1uf,6.3V  [402]  58.42,200.57 0 bottom
C111  0.1uf,6.3V  [402]  58.42,198.17 0 bottom
C112  0.1uf,6.3V  [402]  58.42,195.77 0 bottom
C113  0.1uf,6.3V  [402]  58.42,194.17 0 bottom
C114  0.1uf,6.3V  [402]  68.58,206.17 180 bottom
C115  0.1uf,6.3V  [402]  68.58,204.57 180 bottom
C116  0.1uf,6.3V  [402]  68.58,202.97 180 bottom
C117  0.1uf,6.3V  [402]  68.58,200.57 180 bottom
C118  10uF,10V  [805]  67.94,207.71 0 bottom
C119  0.1uf,6.3V  [402]  68.58,199.37 180 bottom
C120  0.1uf,6.3V  [402]  68.58,195.77 180 bottom
C121  0.1uf,6.3V  [402]  68.58,194.17 180 bottom
C122  10uF,10V  [805]  67.94,191.83 0 bottom
C123  0.001uf,50V  [402]  63.5,199.37 180 bottom
C124  0.1uf,6.3V  [402]  63.5,196.97 0 bottom
C125  2.2uF,6.3V  [402]  32.38,222 90 bottom
C126  10uF,10V  [805]  23.5,216.92 90 bottom
C127  0.1uf,6.3V  [402]  25.4,216.92 270 bottom
C128  0.1uf,6.3V  [402]  29.21,216.92 90 bottom
C129  0.1uf,6.3V  [402]  30.48,216.92 270 bottom
C130  0.1uf,6.3V  [402]  34.29,216.92 270 bottom
C131  0.1uf,6.3V  [402]  23.5,203.58 180 bottom
C132  0.1uf,6.3V  [402]  23.5,204.85 180 bottom
C133  10uF,10V  [805]  23.5,208.34 0 bottom
C134  1uF,10V  [402]  26.67,203.58 0 bottom
C135  0.1uf,6.3V  [402]  26.67,208.66 180 bottom
C136  470pF,6.3V  [0402]  26.67,204.85 0 bottom
C137  15pF,DNI  [402]  12.06,209.3 0 bottom
C138  15pF,DNI  [402]  12.06,208.03 0 bottom
C139  15pF,DNI  [402]  12.06,206.76 0 bottom
C140  15pF,DNI  [402]  12.06,202.95 0 bottom
C141  0.022uF,10V  [402]  12.06,205.49 0 bottom
C142  30pF,50V  [402]  23.18,200.72 90 bottom
C143  30pF,50V  [402]  26.99,200.72 90 bottom
C144  2.2uF,6.3V  [402]  59.05,215.65 270 bottom
C145  0.1uf,6.3V  [402]  59.05,211.2 270 bottom
C146  2.2uF,6.3V  [402]  64.14,218.82 270 bottom
C147  0.1uf,6.3V  [402]  65.41,211.2 90 bottom
C148  2.2uF,6.3V  [402]  65.41,218.82 270 bottom
C149  0.1uf,6.3V  [402]  67.94,218.82 90 bottom
C150  0.1uf,6.3V  [402]  67.94,215.65 90 bottom
C151  2.2uF,6.3V  [402]  66.67,211.2 270 bottom
C152  0.1uf,6.3V  [402]  26.04,196.91 90 bottom
C153  10uF,10V  [805]  81.28,212.72 90 top
C154  0.1uf,6.3V  [402]  83.19,212.72 90 top
C155  0.1uf,6.3V  [402]  55.37,186.44 270 bottom
C156  47pf,6.3V  [402]  55.24,218.95 90 top
C157  47pf,6.3V  [402]  53.98,215.39 90 top
C158  0.1uf,6.3V  [402]  39.69,222 90 bottom
C159  0.1uf,6.3V  [402]  39.69,216.92 270 bottom
C160  47pf,6.3V  [402]  55.24,215.39 270 top
C161  47pf,6.3V  [402]  51.44,215.39 90 bottom
C162  47pf,6.3V  [402]  52.7,215.39 90 bottom
C163  47pf,6.3V  [402]  56.52,215.39 90 top
C164  47pf,6.3V  [402]  50.16,215.39 90 bottom
C165  47pf,6.3V  [402]  55.24,222 270 top
C166  47pf,6.3V  [402]  52.7,215.39 90 top
C167  47pf,6.3V  [402]  53.98,218.95 270 top
C168  47pf,6.3V  [402]  52.7,218.95 90 top
C169  47pf,6.3V  [402]  56.52,212.34 270 top
C170  47pf,6.3V  [402]  53.98,215.39 90 bottom
C171  47pf,6.3V  [402]  75.56,222 270 bottom
C172  47pf,6.3V  [402]  55.24,215.39 90 bottom
C173  47pf,6.3V  [402]  75.56,222 270 top
D1  LTST-C191TBKT  [LED_0603]  3.81,190.88 0 top
D2  LTST-C191TBKT  [LED_0603]  3.17,222.31 0 top
D3  LTST-C191TBKT  [LED_0603]  3.17,220.41 0 top
D4  LTST-C191TBKT  [LED_0603]  3.17,218.5 0 top
D5  LTST-C191TBKT  [LED_0603]  3.17,216.6 0 top
D6  IP4283CZ10-TT  [TSSOP10]  75.56,209.93 270 top
D7  IP4283CZ10-TT  [TSSOP10]  75.56,214.38 270 top
D8  RB751V40,115  [SOD323]  73.03,204.85 90 top
FB1  150OHM800mA  [SM-7351-IND-0805]  34.29,207.07 180 bottom
FB2  150OHM800mA  [SM-7351-IND-0805]  46.35,191.2 270 bottom
FB3  150OHM800mA  [SM-7351-IND-0805]  43.81,191.2 270 bottom
FB4  150OHM800mA  [SM-7351-IND-0805]  23.5,210.88 0 bottom
FB5  150OHM800mA  [SM-7351-IND-0805]  55.88,211.84 270 bottom
FB7  150OHM800mA  [SM-7351-IND-0805]  67.94,186.18 180 bottom
FB8  0.1 Ohm,0805  [SM-7351-IND-0805]  64.01,186.18 180 bottom
FZ3  [FUD40C]  17.14,222.31 270 top
FZ4  [FUD40C]  73.03,182.63 270 bottom
FZ5  [FUD40C]  17.14,222.31 270 bottom
FZ6  [FUD40C]  73.03,182.63 270 top
FZ7  [FUD40C]  5.08,177.86 270 top
FZ8  [FUD40C]  5.08,177.86 270 bottom
J1  HEADER 6  [SIP6]  42.55,182.63 90 top
L1  LQM2HPN2R2MG0L  [2520]  21.53,183.58 0 bottom
L2  LQM2HPN2R2MG0L  [2520]  25.65,183.58 180 bottom
L3  LQM2HPN2R2MG0L  [2520]  28.89,190.25 270 bottom
MECH1  [CREATIVE_COMMONS_NOTE]  319.53,0.76 0 top
MECH2  [CREATIVE_COMMONS_NOTE]  -34.92,127.38 0 top  (outside the outline)
MTG1  MHOLE  [MTGH200C125D_PL]  14.61,178.18 90 top
MTG2  MHOLE  [MTGH200C125D_PL]  80.64,181.36 90 top
MTG3  MHOLE  [MTGH200C125D_PL]  14.61,226.44 90 top
MTG4  MHOLE  [MTGH200C125D_PL]  80.64,223.27 90 top
P1  PJ-200A  [CONN3-PWR-PJ102A]  11.18,184.53 180 top
P2  CTI JTAG,DNI  [HEADER10X2_SMD]  35.24,188.02 90 bottom
P3  87520-0010BLF  [USB_A_SH]  73.34,188.34 90 top
P4  USB5MINI  [USB5MINI_4SHIELDED_SMD-5]  6.1,219.14 180 bottom
P5  LPJ0011BBNL  [RJ45-7499010211A]  14.61,209.3 270 top
P6  10118241-001RLF  [CONN19_HDMI]  84.65,200.15 270 bottom
P8  FEMALE HEADER 2x23  [HEADER23X2]  19.68,225.17 0 top
P9  FEMALE HEADER 2x23  [HEADER23X2]  19.68,176.91 0 top
P10  SCHA5B0200  [SD-MICRO-SCHA5B0300]  81.6,212.72 270 bottom
Q1  B  [SMINI6-F3-B]  13.02,221.36 180 top
Q2  B  [SMINI6-F3-B]  9.53,221.36 180 top
R1  100K,1%  [402]  23.18,196.91 270 bottom
R3  1.5K,1%  [402]  26.04,196.91 270 top
R4  1.5K,1%  [402]  26.99,196.91 270 top
R5  0,1%  [402]  16.19,190.88 180 top
R6  0,1%  [402]  18.8,183.64 270 bottom
R7  0,1%  [402]  11.43,190.88 180 top
R8  0,DNI  [402]  11.43,192.15 180 top
R9  0,1%  [402]  11.43,193.42 0 top
R10  470K,1%  [402]  8.26,192.15 180 top
R11  280K,1%  [402]  8.26,193.42 180 bottom
R12  820,5%  [402]  3.81,191.52 0 bottom
R14  10K,1%  [402]  28.89,187.07 0 bottom
R17  1M,1%  [402]  45.21,214 0 bottom
R18  33  [0402]  41.91,186.44 270 bottom
R19  0,1%  [402]  41.59,194.69 270 bottom
R20  0,1%  [402]  42.55,194.69 90 bottom
R21  33  [0402]  48.26,186.44 270 bottom
R22  49.9,1%  [402]  55.88,203.42 0 bottom
R23  4.75K,1%  [402]  36.83,187.39 270 top
R24  4.75K,1%  [402]  36.83,189.61 90 top
R25  4.75K,1%  [402]  36.83,183.58 90 top
R26  4.75K,1%  [402]  50.16,194.69 90 bottom
R27  0,1%  [402]  44.61,194.37 180 top
R28  33  [0402]  34.29,202.82 180 top
R45  33  [0402]  50.16,218.95 90 top
R46  33  [0402]  51.44,218.95 90 top
R47  33  [0402]  51.44,215.39 90 top
R48  33  [0402]  50.16,215.39 90 top
R49  0,1%  [402]  38.1,208.98 180 bottom
R50  0,1%  [402]  36.83,192.79 270 top
R51  0,1%  [402]  40.64,194.69 90 bottom
R52  10K,1%  [402]  83.16,193.42 270 bottom
R53  10K,1%  [402]  76.81,193.42 90 bottom
R54  10K,1%  [402]  51.12,194.69 90 bottom
R55  100K,1%,DNI  [402]  58.42,222 90 bottom
R56  100K,1%  [402]  57.47,222 90 bottom
R57  100K,1%,DNI  [402]  60.33,222 90 bottom
R58  100K,1%,DNI  [402]  61.28,222 90 bottom
R59  100K,1%,DNI  [402]  59.37,222 90 bottom
R60  100K,1%,DNI  [402]  62.23,222 90 bottom
R61  100K,1%,DNI  [402]  63.18,222 90 bottom
R62  100K,1%,DNI  [402]  64.14,222 90 bottom
R63  100K,1%,DNI  [402]  65.09,222 90 bottom
R64  100K,1%,DNI  [402]  66.04,222 90 bottom
R65  100K,1%  [402]  66.99,222 90 bottom
R66  100K,1%  [402]  67.94,222 90 bottom
R67  100K,1%  [402]  68.9,222 90 bottom
R68  100K,1%  [402]  69.85,222 90 bottom
R69  100K,1%,DNI  [402]  70.8,222 90 bottom
R70  100K,1%,DNI  [402]  71.75,222 90 bottom
R71  820,5%  [402]  6.35,219.46 180 top
R72  820,5%  [402]  6.35,222.31 180 top
R73  820,5%  [402]  6.35,221.36 180 top
R74  820,5%  [402]  6.35,220.41 180 top
R75  100,1%  [402]  73.66,222 270 top
R76  100K,1%  [402]  13.02,221.04 90 bottom
R77  100K,1%  [402]  14.29,221.04 270 bottom
R78  100K,1%  [402]  9.53,221.04 90 bottom
R79  100K,1%  [402]  10.79,221.04 270 bottom
R80  100K,1%  [402]  58.42,222 270 top
R81  100K,1%,DNI  [402]  57.47,222 270 top
R82  100K,1%  [402]  60.33,222 270 top
R83  100K,1%  [402]  61.28,222 270 top
R84  100K,1%  [402]  59.37,222 270 top
R85  100K,1%  [402]  62.23,222 270 top
R86  100K,1%  [402]  63.18,222 270 top
R87  100K,1%  [402]  64.14,222 270 top
R88  100K,1%  [402]  65.09,222 270 top
R89  100K,1%  [402]  66.04,222 270 top
R90  100K,1%,DNI  [402]  66.99,222 270 top
R91  100K,1%,DNI  [402]  67.94,222 270 top
R92  100K,1%,DNI  [402]  68.9,222 270 top
R93  100K,1%,DNI  [402]  69.85,222 270 top
R94  100K,1%  [402]  70.8,222 270 top
R95  100K,1%  [402]  71.75,222 270 top
R96  10K,1%  [402]  68.58,198.17 0 bottom
R97  1.5K,1%  [402]  63.5,194.17 0 bottom
R98  10K,1%  [402]  63.5,200.57 0 bottom
R99  240  [SM-7351-RES-0402]  68.58,196.97 0 bottom
R100  10K,1%  [402]  63.5,198.17 0 bottom
R101  10K,1%  [402]  48.9,222 90 bottom
R102  10K,1%  [402]  46.35,222 90 bottom
R103  10K,1%  [402]  26.04,222 90 bottom
R104  10K,1%  [402]  27.3,222 90 bottom
R105  10K,1%  [402]  47.62,222 90 bottom
R106  10K,1%  [402]  43.81,222 90 bottom
R107  10K,1%  [402]  23.5,222 90 bottom
R108  10K,1%  [402]  24.77,222 90 bottom
R109  10K,1%  [402]  42.55,222 90 bottom
R110  10K,1%  [402]  45.09,222 90 bottom
R111  10K,1%  [402]  29.21,222 270 bottom
R112  1.5K,1%  [402]  30.48,205.8 180 bottom
R113  1.5K,1%  [402]  30.48,208.66 180 bottom
R114  1.5K,1%  [402]  30.48,204.85 180 bottom
R115  10K,1%  [402]  30.48,206.76 180 bottom
R116  10K,1%  [402]  30.48,202.95 180 bottom
R117  10K,1%  [402]  30.48,203.9 180 bottom
R118  10K,1%  [402]  30.48,201.04 0 top
R119  1.5K,1%  [402]  30.48,208.66 180 top
R120  49.9,1%  [402]  20,204.22 0 bottom
R121  49.9,1%  [402]  20,205.17 0 bottom
R122  49.9,1%  [402]  20,206.12 0 bottom
R123  49.9,1%  [402]  20,207.07 0 bottom
R124  10,1%,DNI  [402]  30.48,201.99 180 top
R125  100,1%  [402]  30.48,202.95 180 top
R126  100,1%  [402]  30.48,203.9 180 top
R127  100,1%  [402]  30.48,204.85 180 top
R128  100,1%  [402]  30.48,205.8 180 top
R129  100,1%  [402]  20,208.66 180 bottom
R130  470,5%  [402]  5.71,202.95 0 bottom
R131  100,1%  [402]  30.48,201.99 0 bottom
R132  470,5%  [402]  5.71,206.76 0 bottom
R133  100,1%  [402]  30.48,206.76 180 top
R134  100,1%  [402]  30.48,210.57 0 bottom
R135  10K,1%  [402]  5.71,201.68 180 bottom
R136  .1,0805  [805]  4.13,204.85 0 bottom
R137  0,1%  [402]  12.06,204.22 0 bottom
R138  100,1%  [402]  30.48,207.71 0 bottom
R139  100,1%  [402]  30.48,207.71 180 top
R140  0,1%,DNI  [402]  30.48,201.04 0 bottom
R141  1M,1%,DNI  [402]  25.08,200.72 270 bottom
R142  0,1%  [402]  26.04,200.72 90 bottom
R143  10,1%  [402]  24.13,200.72 270 bottom
R144  12.1K,1%  [402]  20,203.26 0 bottom
R145  10K,1%  [402]  30.48,209.61 180 bottom
R146  1.5K,1%  [402]  76.83,201.99 180 bottom
R147  1.5K1%  [402]  76.83,203.26 180 bottom
R148  10K,1%  [402]  67.94,211.2 270 bottom
R149  0,1%  [402]  66.67,218.82 270 bottom
R150  10K,1%  [402]  81.28,217.17 90 top
R151  10K,1%  [402]  83.19,217.17 90 top
R152  10K,1%  [402]  83.19,208.28 270 top
R153  10K,1%  [402]  82.23,208.28 270 top
R154  10K,1%  [402]  81.28,208.28 270 top
R155  10K,1%  [402]  82.23,217.17 90 top
R156  10K,1%  [402]  25.08,196.91 90 bottom
R157  10K,1%  [402]  71.75,218.19 270 top
R158  10K,1%  [402]  38.1,213.42 0 bottom
R159  0,1%  [402]  23.5,213.42 180 bottom
R160  0,1%  [402]  38.42,216.92 90 bottom
R161  0,1%  [402]  37.15,216.92 90 bottom
R162  0,1%  [402]  30.48,222 270 bottom
R163  4.75K,1%  [402]  47.94,191.2 90 bottom
R164  4.75K,1%  [402]  49.21,191.2 90 bottom
R165  100K,1%  [402]  46.35,186.44 90 top
R166  27K,1%  [402]  73.03,201.68 270 top
R167  33  [0402]  40.96,216.92 270 bottom
RT1  PTC_RXEF010  [POLYSW200-5638-310]  70.48,188.34 90 top
S1  KMR231GLFS  [SW4SMD_63X161LS]  7.94,226.44 180 top
S2  KMR231GLFS  [SW4SMD_63X161LS]  75.56,218.19 180 top
S3  KMR231GLFS  [SW4SMD_63X161LS]  7.94,216.92 180 top
TP1  TESTPT1  [TP1-8040]  59.05,185.8 0 top
TP2  TESTPT1  [TP60C_SMD]  57.47,190.56 0 top
TP3  TESTPT1  [TP60C_SMD]  51.44,194.69 0 top
TP4  TESTPT1  [TP1-8040]  3.81,194.06 0 top
TP5  TESTPT1  [TP60C33D]  14.73,185.67 0 top
TP6  TESTPT1  [TP60C33D]  14.73,183.13 0 top
TP7  TESTPT1  [TP60C33D]  17.27,185.67 0 top
TP8  TESTPT1  [TP60C33D]  17.27,183.13 0 top
U2  TPS65217C  [U_48_RSL]  22.86,190.25 0 top
U3  SN74LVC1G06DCK  [DCK5_2P15X1P4]  40.32,220.73 0 top
U4  TL5209  [SO8-25X75]  13.65,191.52 90 bottom
U5  C  [AM33XX_15X15]  45.72,204.22 180 top
U6  SN74AUC1G74  [SOP8_DCT]  45.09,186.44 90 bottom
U7  24LC32A  [SOT23-5]  29.53,196.91 270 bottom
U8  TPS2051 (DGN)  [DGN-16X60]  79.35,189.61 90 bottom
U9  TPD4S012  [U_6_DRY]  79.35,193.42 90 bottom
U10  TPD4S012  [U_6_DRY]  13.02,216.92 270 top
U11  TDA19988  [QFN64S9X9P5]  63.5,215.01 0 top
U12  MT41K256M16HA -125:E  [BGA96_T9_P8_9X14]  63.5,199.77 0 top
U13  MEM_MNAND_2GB  [BGA153_P14_P5_11P5X13]  29.84,216.92 270 top
U14  LAN8710A  [QFN32_5X5MM_EP3P3MM]  25.08,206.12 0 top
U15  SN74LVC2G241  [U_8_DCU]  52.58,186.44 90 bottom
Y1  32.768KHz MC-306  [XTAL4_126-216SMD]  51.12,188.98 270 top
Y2  24MHz  [XTAL150SMD_125X196]  45.21,216.41 180 bottom
Y3  25.000MHz  [XTAL150SMD_125X196]  25.08,200.72 180 top
Y4  24.576MHZ  [OSC4_61X65LS_79X98SMD]  40.32,216.6 0 top

## Tracks (layer width: path | path; a pad name or v marks a point on that pad's centre or on a via)
12M_LOOP
  Bottom 0.121: U6.3 44.45,186.76 44.58,186.63 44.58,186.24 44.45,186.11 U6.2
12MHZ  (via drill 0.2 pad 0.46)
  Top 0.121: v64.9,209.8 64.75,209.95 U11.27
  Route14 0.133: v60.2,187.45 61.98,189.23 66.36,189.23 69.41,192.28 70.48,192.28 71.37,193.17 71.37,208.15 69.22,210.31 65.41,210.31 v64.9,209.8
  Bottom 0.121: R21.2 48.77,185.93 49.02,186.18 49.02,187.45 49.66,188.09 59.56,188.09 v60.2,187.45
AIN0
  Top 0.121: P9.39 66.67,178.18 66.67,179.96 65.41,181.23 62.61,181.23 59.18,184.66 48.26,184.66 47.86,185.06 47.86,194.8 48.51,195.45 48.51,196.77 48.12,197.17 48.12,197.82 U5.B6
AIN1  (via drill 0.2 pad 0.46)
  Top 0.121: v48.12,198.62 U5.C7
  Route14 0.133: P9.40 66.29,181.1 60.71,181.1 54.1,187.71 54.1,189.99 51.56,192.53 51.56,192.92 51.29,193.19 51.28,193.19 48.51,195.96 48.51,198.22 v48.12,198.62
AIN2
  Top 0.121: P9.37 64.26,178.05 64.26,180.09 63.63,180.72 62.1,180.72 58.67,184.15 47.75,184.15 47.37,184.54 47.37,195.07 48.01,195.71 48.01,196.52 47.32,197.21 47.32,197.81 U5.B7
AIN3
  Top 0.121: P9.38 63.88,180.97 62.36,180.97 58.93,184.4 48.01,184.4 47.61,184.8 47.61,194.93 48.27,195.59 48.27,196.64 47.72,197.19 U5.A7
AIN4  (via drill 0.2 pad 0.46)
  Top 0.121: U5.C8 | U5.C8 v47.32,198.62
  Route14 0.133: P9.33 61.59,178.18 61.59,179.71 53.72,187.58 53.72,189.52 50.67,192.57 50.67,193.29 48.13,195.83 48.13,197.8 v47.32,198.62
AIN5
  Top 0.121: P9.36 62.43,179.45 58.24,183.64 47.24,183.64 46.86,184.02 46.86,196.85 46.52,197.19 46.52,197.82 U5.B8
AIN6
  Top 0.121: U5.A8 46.92,197.17 47.75,196.34 47.75,195.83 47.12,195.2 47.12,184.28 47.5,183.9 58.42,183.9 61.85,180.47 63.37,180.47 63.88,179.96 63.88,177.93 P9.35
AIN7  (via drill 0.2 pad 0.46)
  Top 0.121: U5.C9 v46.52,198.62
  Route14 0.133: v46.52,198.62 47.75,197.38 47.75,193.29 v48.26,192.79
  Bottom 0.121: v48.26,192.79 47.94,192.47 R163.2 48.39,191.71 48.58,191.52 48.58,190.88 48.77,190.69 R164.1
B_UART0_RX
  Top 0.121: R165.1 46.35,182.25 47.12,181.48 49.02,181.48 J1.4
  Bottom 0.121: U15.2 51.94,186.19 52.2,185.93 52.2,184.66 J1.4
B_UART0_TX
  Bottom 0.121: J1.5 52.7,183.64 52.45,183.9 52.45,186.18 51.95,186.69 U15.3
CAP_VBB_MPU  (via drill 0.2 pad 0.46)
  Top 0.121: U5.C10 44.93,198.63 v44.92,198.62
  Bottom 0.121: C91.1 45.4,197.42 44.92,197.9 v44.92,198.62
CAP_VDD_SRAM_CORE  (via drill 0.2 pad 0.46)
  Top 0.121: U5.D9 v46.52,199.42 v46.52,199.41
  Bottom 0.121: C89.1 46.35,197.49 46.92,198.05 46.92,199.01 v46.52,199.41
CAP_VDD_SRAM_MPU  (via drill 0.2 pad 0.46)
  Top 0.121: v44.12,199.41 U5.D11
  Bottom 0.121: C90.1 44.52,195.27 44.52,199.01 v44.12,199.41
CLKOUT2
  Bottom 0.121: P2.18 36.01,192.47 35.67,192.81 35.67,194.98 36.27,195.58 39.88,195.58 40.13,195.83 40.89,195.83 41.08,195.64 41.08,194.69 R19.2 R20.1 42.55,193.55 41.59,192.6 41.59,189.29 42.23,188.66 46.7,188.66 46.89,188.85 60.71,188.85 61.72,187.83 61.72,184.91 65.15,181.48 69.98,181.48 71.63,179.83 71.63,178.05 P9.41
CLKOUT_SRC  (via drill 0.2 pad 0.46)
  Top 0.121: U5.D14 v41.72,199.41
  Bottom 0.121: R19.1 41.59,197.99 41.32,198.27 41.32,199.01 v41.72,199.41
CRS  (via drill 0.2 pad 0.46)
  Top 0.121: U14.14 28.35,206.87 v28.45,206.77 28.92,207.25 29.51,207.25 R139.2
DDR_A0  (via drill 0.2 pad 0.46)
  Top 0.121: v61.5,195.77 U12.N3 | U5.F3 v51.32,201.02
  Route3 0.133: v61.5,195.77 61.82,196.09 61.98,196.09 62.36,195.71 62.36,192.91 61.59,192.15 57.02,192.15 54.86,194.31 54.86,194.56 53.21,196.22 53.21,197.99 53.34,198.12 v53.85,198.12
  Bottom 0.121: v51.32,201.02 51.73,201.42 52.32,201.42 52.58,201.17 52.58,199.39 v53.85,198.12
DDR_A1  (via drill 0.2 pad 0.46)
  Top 0.121: v65.5,194.97 U12.P7 | v58.93,198.88 58.93,199.77 57.72,200.98 56.58,200.98 54.54,203.02 U5.H1
  Route3 0.121: 61.67,198.57 60.5,198.57 60.2,198.88
  Route3 0.133: v65.5,194.97 65.14,195.33 64.9,195.33 64.77,195.2 64.77,194.69 64.64,194.56 64.39,194.56 64.26,194.69 64.26,195.2 64.14,195.33 64.01,195.33 63.88,195.2 63.88,194.31 64.01,194.18 64.39,194.18 64.52,194.06 64.52,193.9 64.39,193.78 63.63,193.78 63.5,193.9 63.5,195.45 63.88,195.83 63.88,196.85 62.61,198.12 62.23,198.12 61.78,198.57 61.67,198.57 | 60.2,198.88 v58.93,198.88
DDR_A2  (via drill 0.2 pad 0.46)
  Top 0.121: v61.5,194.97 U12.P3 | U5.E4 v50.52,200.22
  Route3 0.121: 61.1,197.09 61.1,195.37 v61.5,194.97
  Route3 0.133: v50.52,200.22 50.52,199.99 51.12,199.39 54.36,199.39 55.12,200.15 55.12,201.04 54.26,201.9 54.26,202.08 54.5,202.33 54.72,202.33 56.64,200.41 56.64,199.39 56.77,199.26 57.4,199.26 57.51,199.16 57.51,198.73 57.4,198.63 56.77,198.63 56.64,198.5 56.64,197.1 56.77,196.98 59.05,196.98 59.44,197.36 60.83,197.36 61.1,197.09
DDR_A3  (via drill 0.2 pad 0.46)
  Top 0.121: v51.32,198.62 U5.C3 | v60.7,195.77 U12.N2
  Route3 0.121: v60.7,195.77 60.3,196.17 59.61,196.17
  Route3 0.133: 59.61,196.17 59.56,196.22 56.01,196.22 55.88,196.34 55.88,199.44 55.8,199.52 55.58,199.52 55.5,199.44 55.5,197.21 55.42,197.13 55.07,197.13 54.99,197.05 54.99,196.67 54.91,196.6 54.69,196.6 54.61,196.67 54.61,197.05 54.53,197.13 54.37,197.13 54.29,197.21 54.29,197.41 54.37,197.49 55.04,197.49 55.12,197.56 55.12,197.79 55.04,197.87 54.37,197.87 54.29,197.94 54.29,198.17 54.37,198.25 55.04,198.25 55.12,198.32 55.12,198.54 55.04,198.62 52.96,198.62 52.83,198.49 52.83,197.36 52.7,197.23 52.45,197.23 52.32,197.36 52.32,198.49 52.2,198.62 v51.32,198.62
DDR_A4  (via drill 0.2 pad 0.46)
  Top 0.121: U5.C2 52.12,198.62 52.12,198.06 52.36,197.82 52.68,197.82 52.96,197.54 52.96,196.34 53.72,195.58 53.72,194.82 56.52,192.02 56.52,191.64 v56.13,191.26 | v66.3,194.97 U12.P8
  Route3 0.121: 65.28,194.57 65.9,194.57 v66.3,194.97
  Route3 0.133: v56.13,191.26 56.39,191.01 62.36,191.01 63.12,191.77 64.77,191.77 65.02,192.02 65.02,194.31 65.28,194.57
DDR_A5  (via drill 0.2 pad 0.46)
  Top 0.121: v60.7,194.97 U12.P2 | v53.85,197.1 53.47,197.1 53.34,197.23 53.34,197.61 52.74,198.22 U5.B1
  Route3 0.121: v60.7,194.97 61.1,194.57 61.1,193.18 61.09,193.17
  Route3 0.133: 61.09,193.17 60.83,192.91 59.44,192.91 59.31,193.04 59.31,195.71 59.18,195.83 57.78,195.83 57.66,195.71 57.66,193.42 57.53,193.29 56.9,193.29 56.64,193.55 56.64,195.71 56.52,195.83 56.26,195.83 56.13,195.71 56.13,194.69 56.01,194.56 55.75,194.56 55.63,194.69 55.63,196.65 55.55,196.72 55.32,196.72 55.24,196.65 55.24,196.04 55.17,195.96 54.54,195.96 54.29,196.21 54.29,196.66 v53.85,197.1
DDR_A6  (via drill 0.2 pad 0.46)
  Top 0.121: v49.72,199.41 U5.D5 | v66.3,194.17 U12.R8
  Bottom 0.121: v49.72,199.41 50.12,199.81 51.39,199.81 53.59,197.61 53.98,197.61 55.37,196.22 55.37,193.68 57.28,191.77 64.52,191.77 65.9,193.15 65.9,193.77 v66.3,194.17
DDR_A7  (via drill 0.2 pad 0.46)
  Top 0.121: v60.7,194.17 U12.R2 | v57.15,194.92 57.63,194.44 58.17,194.44 58.29,194.31 58.29,193.04 58.17,192.91 57.4,192.91 55.63,194.69 55.63,198.88 54.36,200.15 54.36,200.79 54.13,201.02 52.12,201.02 U5.E2
  Bottom 0.121: v57.15,194.92 59.16,194.92 59.61,195.37 62.23,195.37 62.36,195.24 62.36,194.7 62.23,194.57 U12.R2 v60.7,194.17
DDR_A8  (via drill 0.2 pad 0.46)
  Top 0.121: v66.3,193.37 U12.T8 | v50.52,199.41 U5.D4
  Bottom 0.121: v66.3,193.37 66.3,193.05 64.64,191.39 57.15,191.39 54.99,193.55 54.99,195.69 54.61,196.07 52.19,196.07 51.94,196.32 51.94,198.75 51.28,199.41 v50.52,199.41
DDR_A9  (via drill 0.2 pad 0.46)
  Top 0.121: v61.5,194.17 U12.R3 | U5.C1 53.09,198.45 53.09,198.32 53.79,197.61 54.1,197.61 54.25,197.47 54.25,195.95 54.13,195.83 53.97,195.83 53.85,195.95 v53.85,196.47
  Route3 0.133: v61.5,194.17 61.5,194.44 61.63,194.56 61.85,194.56 61.98,194.44 61.98,193.04 61.47,192.53 58.93,192.53 58.8,192.66 58.8,195.33 58.67,195.45 58.29,195.45 58.17,195.33 58.17,192.66 58.04,192.53 57.15,192.53 55.24,194.44 55.24,195.33 54.99,195.58 54.36,195.58 53.85,196.09 v53.85,196.47
DDR_A10  (via drill 0.2 pad 0.46)
  Top 0.121: v65.5,197.37 U12.L7 | U5.F4 v50.52,201.02
  Route3 0.121: 51.68,201.42 50.92,201.42 v50.52,201.02
  Route3 0.133: v65.5,197.37 65.79,197.66 65.79,197.87 65.66,197.99 64.77,197.99 64.64,198.12 64.64,198.37 64.77,198.5 65.66,198.5 65.79,198.63 65.79,198.88 65.66,199.01 64.39,199.01 62.36,201.04 59.31,201.04 57.72,202.63 56.83,202.63 55.75,203.71 52.58,203.71 52.2,203.33 52.2,201.93 51.68,201.42
DDR_A11  (via drill 0.2 pad 0.46)
  Top 0.121: v65.5,194.17 U12.R7 | U5.F2 52.12,201.82 v53.85,201.82
  Bottom 0.121: v53.85,201.82 53.34,201.31 53.34,199.77 54.61,198.5 55.88,198.5 56.13,198.25 56.13,193.93 57.53,192.53 64.14,192.53 64.77,193.17 64.77,193.92 65.02,194.17 v65.5,194.17
DDR_A12  (via drill 0.2 pad 0.46)
  Top 0.121: v65.5,195.77 U12.N7 | v51.32,200.22 U5.E3
  Route3 0.133: v65.5,195.77 63.88,197.39 63.88,198.37 62.23,200.03 61.47,200.03 61.22,199.78 59.56,199.78 57.91,201.42 56.64,201.42 55.12,202.95 53.21,202.95 52.96,202.69 52.96,201.3 53.21,201.04 54.1,201.04 54.36,200.79 54.36,200.41 54.1,200.15 51.38,200.15 v51.32,200.22
DDR_A13  (via drill 0.2 pad 0.46)
  Top 0.121: v61.5,193.37 U12.T3 | U5.H3 v51.32,202.62
  Bottom 0.121: v61.5,193.37 63.37,193.37 63.5,193.24 63.5,193.04 63.37,192.91 57.66,192.91 56.52,194.06 56.52,198.63 56.26,198.88 54.74,198.88 54.36,199.26 54.36,202.18 53.92,202.62 v51.32,202.62
DDR_A14  (via drill 0.2 pad 0.46)
  Top 0.121: v65.5,193.37 U12.T7 | v50.52,202.62 U5.H4
  Bottom 0.121: v50.52,202.62 50.52,202.59 50.9,202.22 52.55,202.22 52.96,201.8 52.96,199.64 55.75,196.85 55.75,193.8 57.4,192.15 64.28,192.15 v65.5,193.37
DDR_A15
  Top 0.121: U12.M7 64.52,196.39 64.52,192.53 63.88,191.9 57.15,191.9 54.61,194.44 54.61,198.37 53.57,199.41 51.32,199.41 U5.D3
DDR_BA0  (via drill 0.2 pad 0.46)
  Top 0.121: v60.7,196.57 U12.M2 | U5.C4 v50.52,198.62
  Route3 0.121: 50.92,198.75 50.92,197.49 | 50.12,197.49 50.12,198.49 50.25,198.62 v50.52,198.62
  Route3 0.133: v60.7,196.57 60.7,196.85 60.57,196.98 59.56,196.98 59.18,196.6 56.64,196.6 56.26,196.98 56.26,200.28 55.78,200.76 55.59,200.76 55.5,200.66 55.5,200.03 54.49,199.02 51.05,199.02 50.92,198.89 50.92,198.75 | 50.92,197.49 51.05,197.36 51.44,197.36 51.56,197.23 51.56,196.47 51.44,196.34 51.18,196.34 51.05,196.47 51.05,196.85 50.93,196.98 50.67,196.98 50.55,196.85 50.55,196.47 50.42,196.34 50.24,196.34 50.12,196.47 50.12,197.49
DDR_BA1  (via drill 0.2 pad 0.46)
  Top 0.121: U5.E1 v53.85,200.62 | v66.3,195.77 U12.N8
  Route3 0.133: v66.3,195.77 65.82,196.25 65.82,196.66 65.66,196.82 65.05,196.82 64.23,197.64 64.23,198.53 62.1,200.66 61.34,200.66 61.21,200.53 61.21,200.28 61.09,200.15 59.69,200.15 58.08,201.76 56.93,201.76 55.37,203.33 52.83,203.33 52.58,203.07 52.58,201.55 52.32,201.3 52.32,200.91 52.62,200.62 v53.85,200.62
DDR_BA2  (via drill 0.2 pad 0.46)
  Top 0.121: v51.32,197.81 U5.B3 | v61.5,196.57 U12.M3
  Route3 0.133: v51.32,197.81 51.63,198.12 51.82,198.12 51.94,197.99 51.94,195.83 52.07,195.71 52.26,195.71 52.39,195.83 52.39,196.09 52.51,196.22 52.7,196.22 54.48,194.44 54.48,194.18 56.9,191.77 61.98,191.77 62.74,192.53 62.74,195.83 62.48,196.09 62.48,196.34 62.74,196.6 62.74,196.98 62.48,197.23 62.23,197.23 62.1,197.1 62.1,196.7 61.98,196.57 v61.5,196.57
DDR_CASN  (via drill 0.2 pad 0.46)
  Top 0.121: v61.5,198.17 U12.K3 | v57.15,197.49 57.15,196.72 57.28,196.6 58.17,196.6 58.29,196.47 58.29,195.96 58.17,195.83 58.04,195.83 57.91,195.71 57.91,195.45 58.04,195.33 58.17,195.33 58.29,195.2 58.29,194.94 58.17,194.82 57.68,194.82 57.55,194.94 57.55,196.22 57.42,196.34 56.77,196.34 56.64,196.22 56.64,194.82 56.52,194.69 56.13,194.69 56.01,194.82 56.01,199.64 55.88,199.77 55.37,199.77 54.74,200.41 54.74,201.16 54.48,201.42 U5.F1
  Route3 0.133: v61.5,198.17 61.07,197.74 59.31,197.74 59.05,197.49 v57.15,197.49
DDR_CKE  (via drill 0.2 pad 0.46)
  Top 0.121: v67.1,198.17 U12.K9 | U5.G3 v51.32,201.82
  Route3 0.133: v67.1,198.17 67.31,198.38 67.31,199.26 67.18,199.39 64.64,199.39 62.61,201.42 59.44,201.42 57.91,202.95 57.02,202.95 55.88,204.09 53.21,204.09 52.83,204.47 51.18,204.47 51.05,204.34 51.05,204.09 51.18,203.96 51.69,203.96 51.82,203.84 51.82,202.31 v51.32,201.82
  Bottom 0.121: R96.2 v67.1,198.17
DDR_CLK
  Top 0.095: U12.J7 64.94,199.21 64.74,199.21 63.75,198.22 63.75,194.71 61.58,192.53 57.42,192.53 55.27,194.68 55.27,198.73 53.8,200.2 52.36,200.2 51.98,199.82 U5.D2
DDR_CLKN
  Top 0.095: U12.K7 65.37,198.57 65.47,198.68 65.47,198.82 65.37,198.93 64.86,198.93 64.03,198.11 64.03,194.59 61.7,192.25 57.3,192.25 54.99,194.56 54.99,198.61 53.68,199.92 52.63,199.92 U5.D1
DDR_CSN
  Top 0.121: U5.H2 52.12,203.42 54.65,203.42 56.71,201.36 57.85,201.36 59.44,199.77 59.44,198.45 59.36,198.37 58.88,198.37 58.8,198.3 58.8,197.1 59.05,196.85 59.05,193.42 59.18,193.29 59.31,193.29 59.44,193.42 59.44,196.98 59.18,197.23 59.18,197.79 59.26,197.87 59.49,197.87 59.56,197.79 59.56,197.44 59.64,197.37 60.7,197.37 U12.L2
DDR_D0  (via drill 0.2 pad 0.46)
  Top 0.121: v51.32,206.62 U5.M3 | v62.3,202.97 U12.E3
  Route3 0.133: v62.3,202.97 62.3,204.72 62.43,204.85 62.87,204.85 62.99,204.72 62.99,202.44 63.12,202.31 63.63,202.31 63.75,202.44 63.75,204.6 60.45,207.9 52.96,207.9 51.68,206.62 v51.32,206.62
DDR_D1  (via drill 0.2 pad 0.46)
  Top 0.121: v50.52,206.62 U5.M4 | v65.5,202.17 U12.F7
  Route3 0.121: v65.5,202.17 65.9,201.77 66.47,201.77 66.7,201.54 66.7,200.75 66.7,200.4 66.47,200.16 | 52.77,205.42 51.16,205.42 50.92,205.65 50.92,206.22 v50.52,206.62
  Route3 0.133: 66.47,200.16 66.08,199.78 64.89,199.78 62.9,201.76 59.6,201.76 57.4,203.96 56.77,203.96 56.26,204.47 53.72,204.47 52.77,205.42
DDR_D2
  Top 0.121: U5.N1 55.49,207.02 55.88,206.63 57.02,206.63 57.15,206.76 57.15,207.65 57.02,207.77 54.86,207.77 54.74,207.9 54.74,208.15 54.86,208.28 61.09,208.28 61.21,208.15 61.21,207.14 62.73,205.62 62.73,202.44 62.47,202.17 61.98,202.17 61.5,202.17 U12.F2
DDR_D3  (via drill 0.2 pad 0.46)
  Top 0.121: v66.3,202.17 U12.F8 | v56.13,207.14 55.85,207.42 52.12,207.42 U5.N2
  Bottom 0.121: v66.3,202.17 66.7,202.57 66.7,203.18 66.5,203.37 65.91,203.37 65.58,203.71 64.77,203.71 64.64,203.58 64.64,202.69 64.52,202.56 64.26,202.56 64.14,202.69 64.14,203.58 64.01,203.71 63.75,203.71 63.63,203.58 63.63,202.69 63.5,202.56 63.31,202.56 63.18,202.69 63.18,203.26 62.36,204.09 62.36,205.61 60.83,207.14 v56.13,207.14
DDR_D4  (via drill 0.2 pad 0.46)
  Top 0.121: v62.36,207.65 63.37,207.65 64.26,206.76 64.26,200.91 63.52,200.17 U12.H3 | U5.N3 v51.32,207.42
  Route3 0.133: v62.36,207.65 61.34,208.66 52.58,208.66 51.33,207.42 v51.32,207.42
DDR_D5  (via drill 0.2 pad 0.46)
  Top 0.121: v66.3,200.57 U12.H8 | U5.N4 v50.52,207.42
  Route3 0.121: 51.57,207.02 50.92,207.02 v50.52,207.42
  Route3 0.133: v66.3,200.57 65.88,200.15 65.15,200.15 64.26,201.04 64.26,204.72 60.71,208.28 52.83,208.28 51.57,207.02
DDR_D6  (via drill 0.2 pad 0.46)
  Top 0.121: v62.99,207.14 63.88,206.25 63.88,201.04 63.41,200.57 61.5,200.57 U12.G2 | U5.P3 v51.32,208.22
  Route3 0.133: v62.99,207.14 62.99,207.65 61.59,209.04 52.45,209.04 51.63,208.22 v51.32,208.22
DDR_D7  (via drill 0.2 pad 0.46)
  Top 0.121: v65.5,200.57 U12.H7 | U5.P4 v50.52,208.22
  Route3 0.121: 51.52,208.62 50.92,208.62 v50.52,208.22
  Route3 0.133: v65.5,200.57 64.77,201.3 64.77,206.5 61.87,209.4 52.3,209.4 51.52,208.62
DDR_D8